# EAGLE design TG_SAT_24V0_V1.4 (EAGLE 9.4.2)
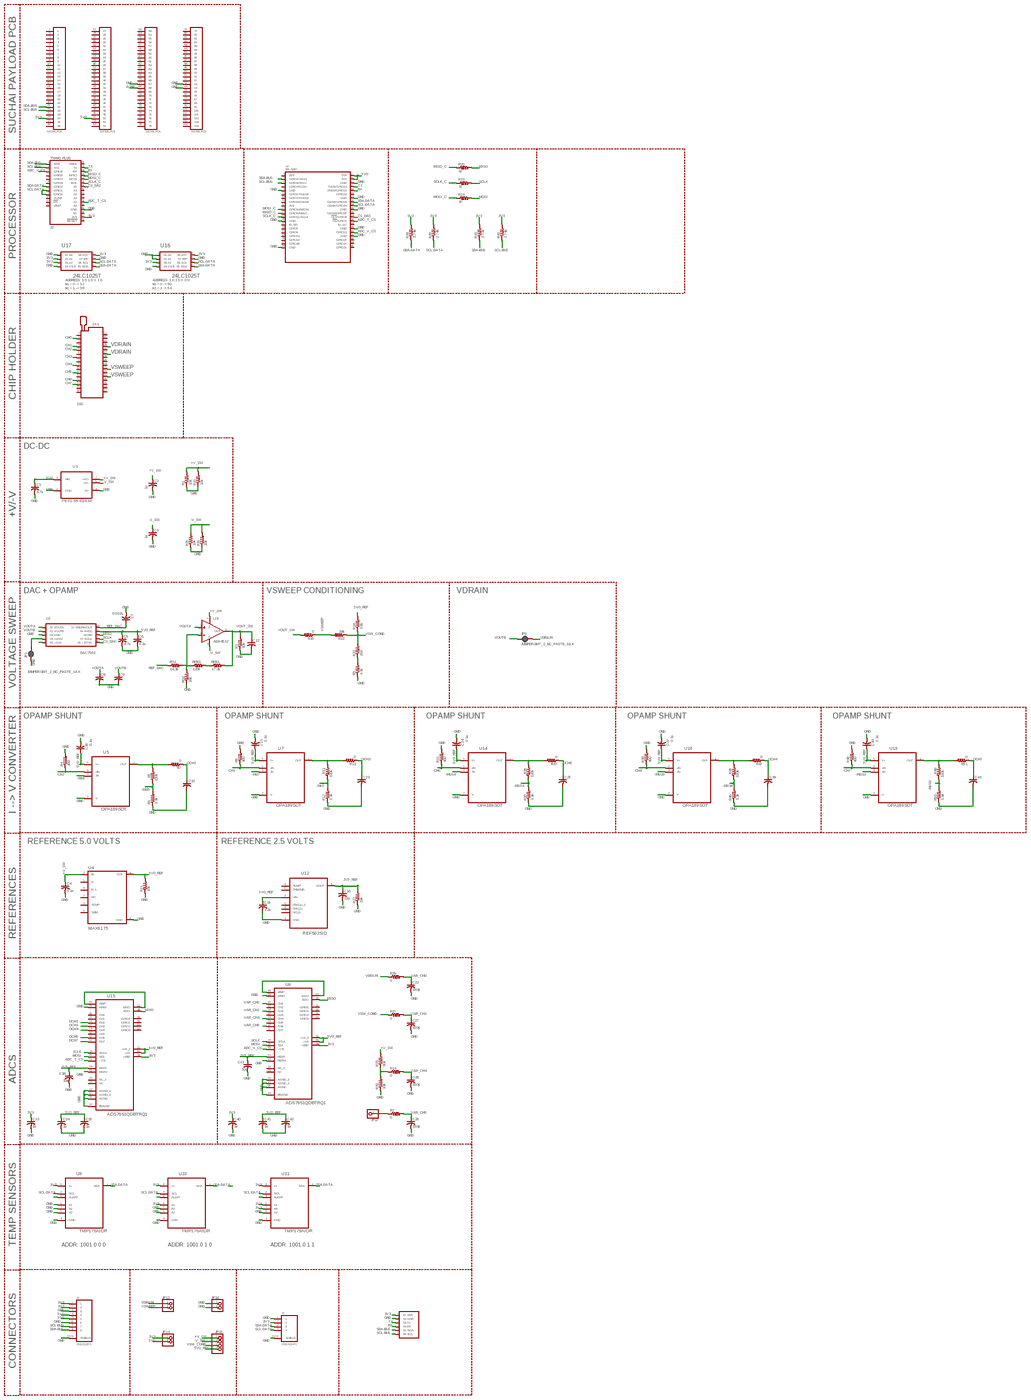
[diagram p0: schematic, sheet 1, overview]
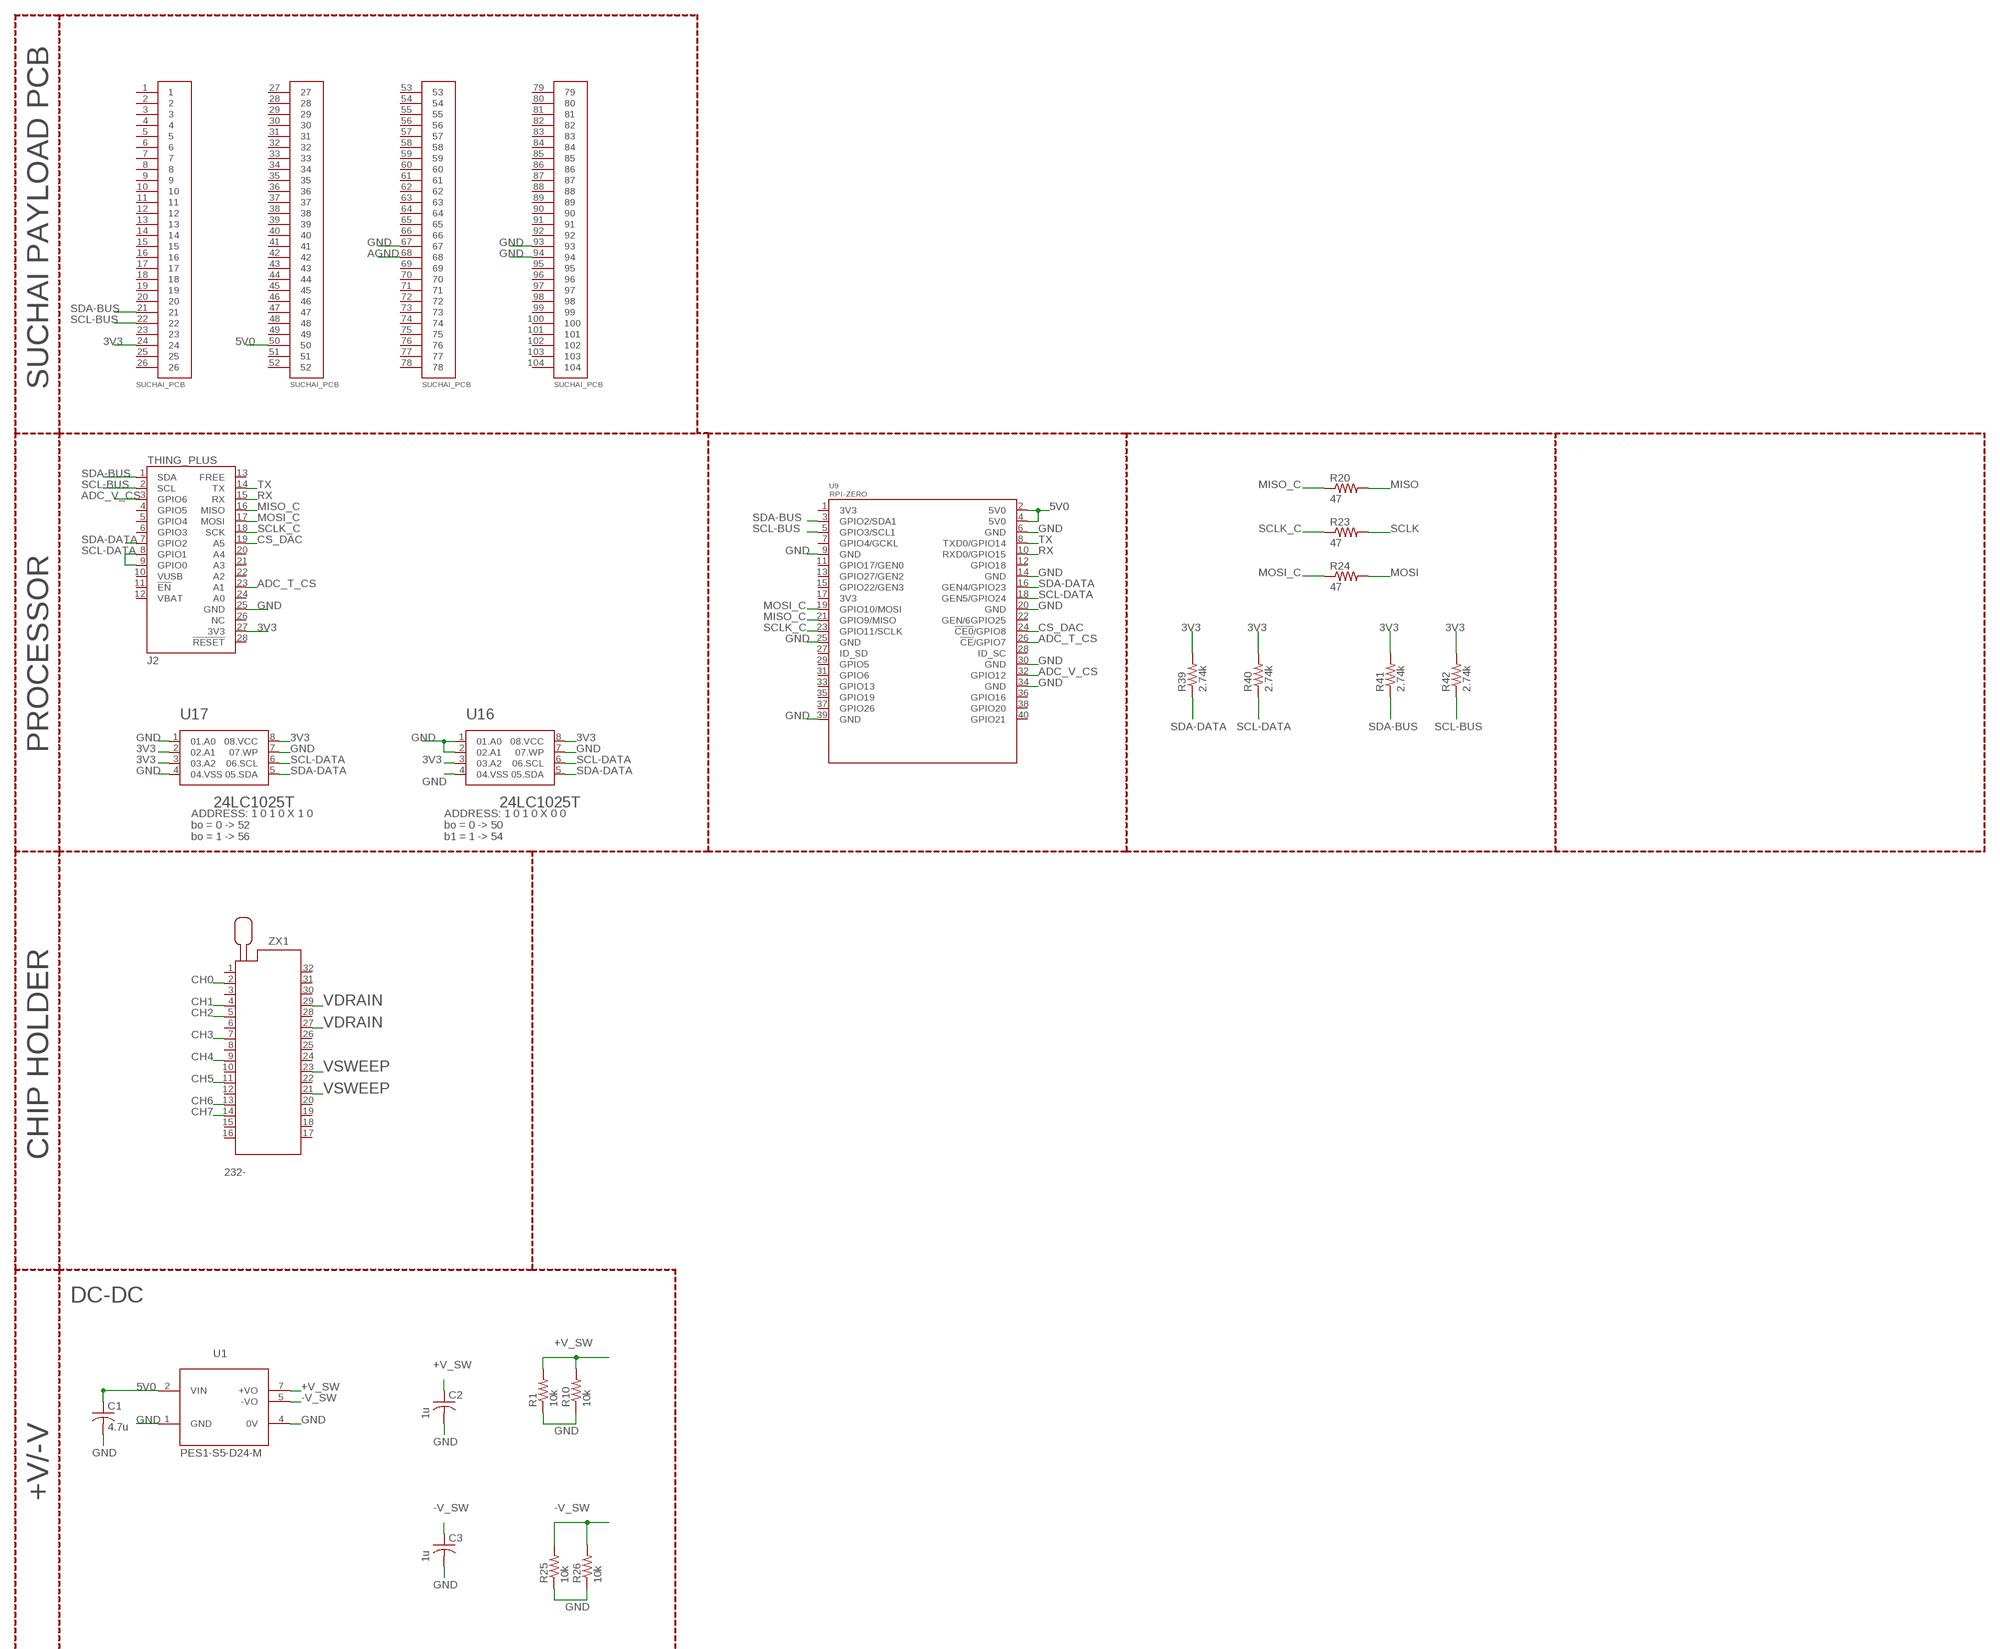
[diagram p1: schematic, sheet 1, part 1 of 4]
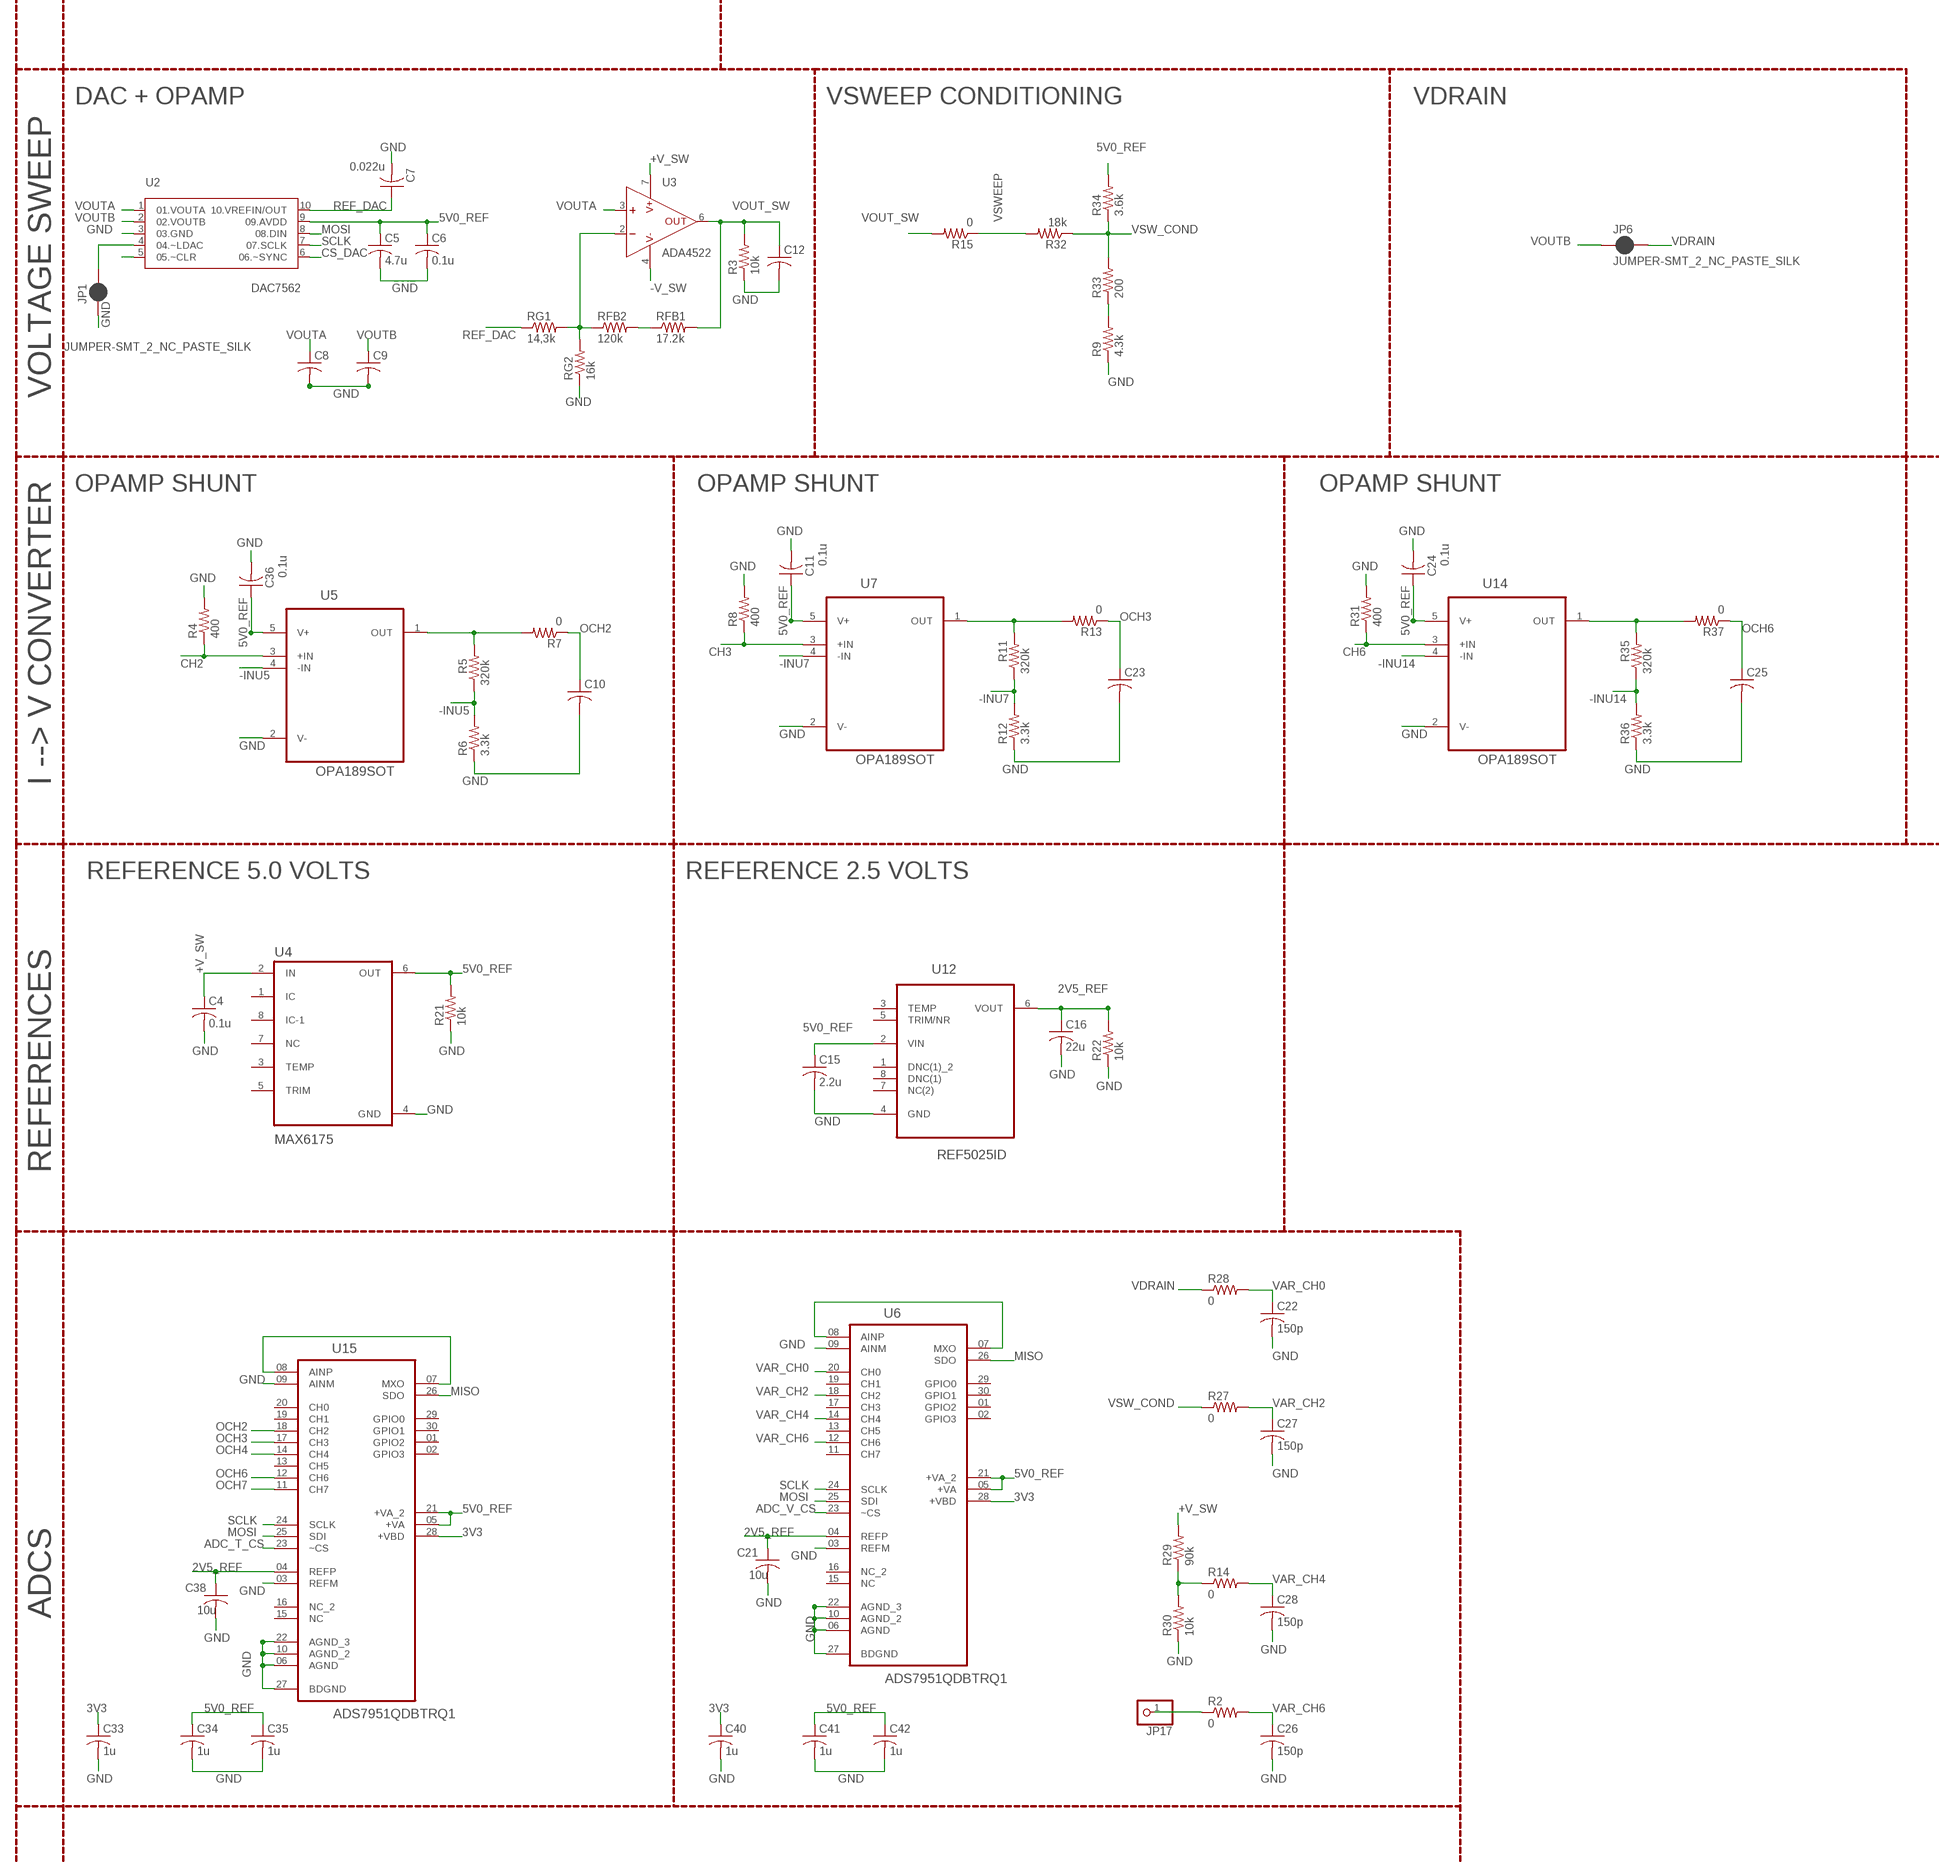
[diagram p2: schematic, sheet 1, part 2 of 4]
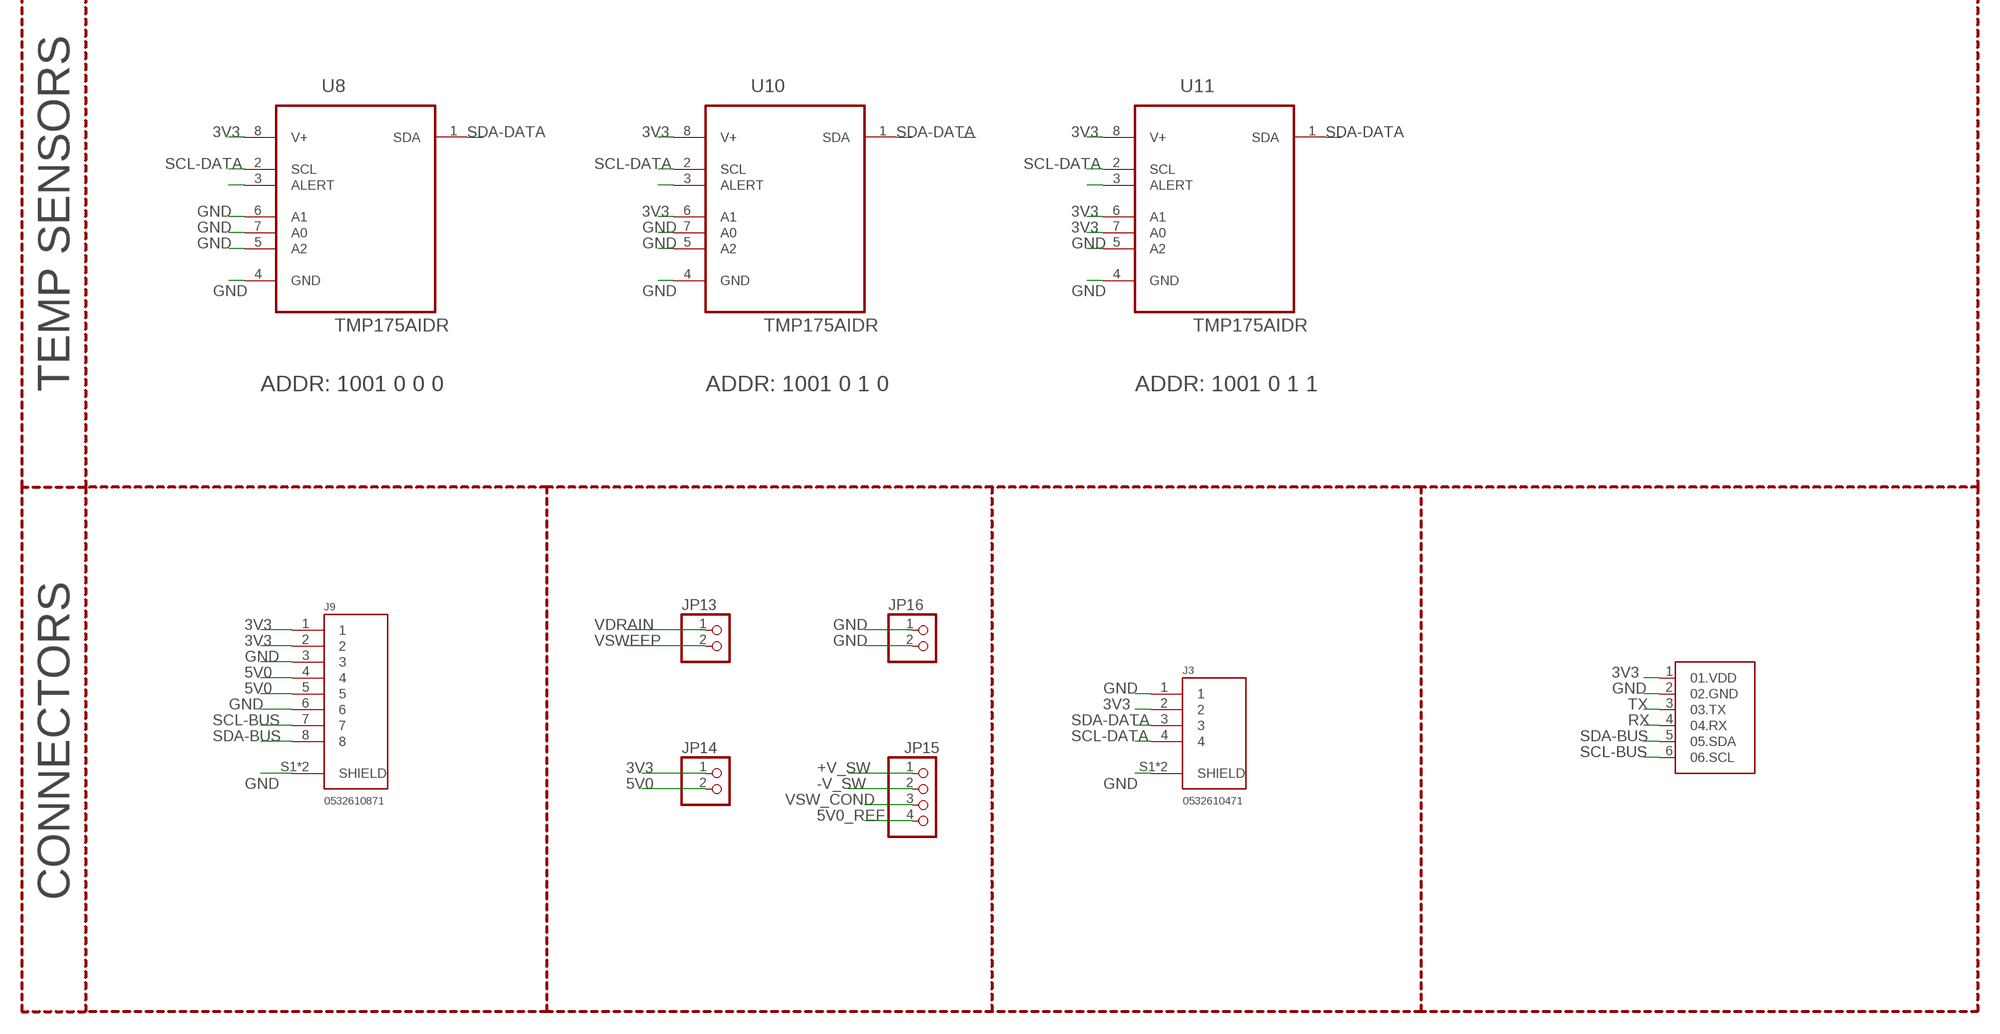
[diagram p3: schematic, sheet 1, part 3 of 4]
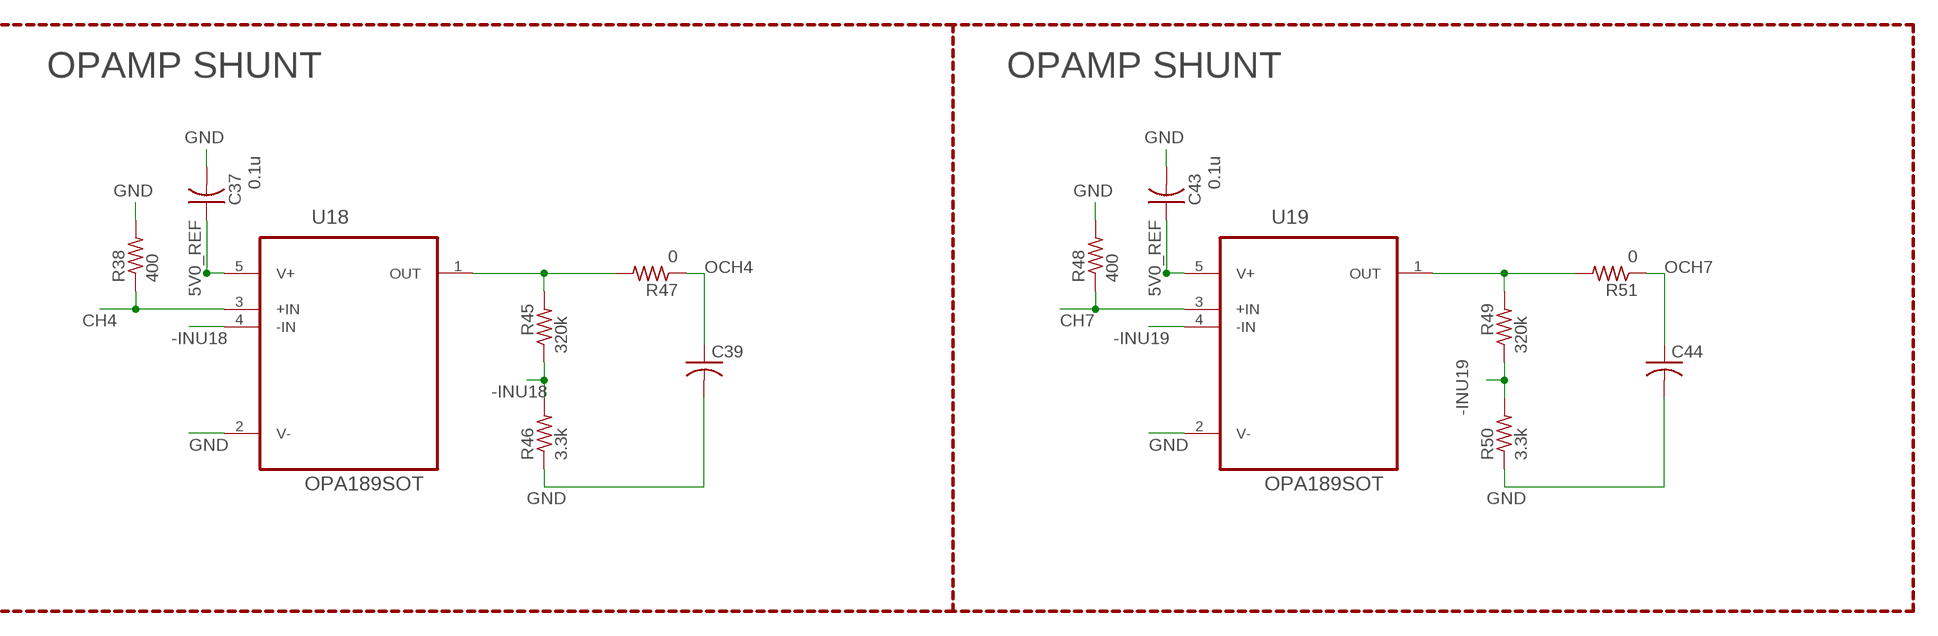
[diagram p4: schematic, sheet 1, part 4 of 4]

## Parts
C1  4.7u  C-USC1206  [C1206]
C2  1u  C-USC0603  [C0603]
C3  1u  C-USC0603  [C0603]
C4  0.1u  C-USC0805  [C0805]
C5  4.7u  C-USC1206  [C1206]
C6  0.1u  C-USC0603  [C0603]
C7  0.022u  C-USC0603  [C0603]
C8  C-USC0603  [C0603]
C9  C-USC0603  [C0603]
C10  C-USC0603  [C0603]
C11  0.1u  C-USC0805  [C0805]
C12  C-USC0603  [C0603]
C15  2.2u  C-USC1206  [C1206]
C16  22u  C-USC1206  [C1206]
C21  10u  C-USC0603  [C0603]
C22  150p  C-USC0603  [C0603]
C23  C-USC0603  [C0603]
C24  0.1u  C-USC0805  [C0805]
C25  C-USC0603  [C0603]
C26  150p  C-USC0603  [C0603]
C27  150p  C-USC0603  [C0603]
C28  150p  C-USC0603  [C0603]
C33  1u  C-USC0603  [C0603]
C34  1u  C-USC0603  [C0603]
C35  1u  C-USC0603  [C0603]
C36  0.1u  C-USC0805  [C0805]
C37  0.1u  C-USC0805  [C0805]
C38  10u  C-USC0603  [C0603]
C39  C-USC0603  [C0603]
C40  1u  C-USC0603  [C0603]
C41  1u  C-USC0603  [C0603]
C42  1u  C-USC0603  [C0603]
C43  0.1u  C-USC0805  [C0805]
C44  C-USC0603  [C0603]
J1  SUCHAI_PCB  [SUCHAI_PCB]
J2  THING_PLUS  [THING_PLUS]
J3  0532610471  [MOLEX_0532610471]
J9  0532610871  [MOLEX_0532610871]
JP1  JUMPER-SMT_2_NC_PASTE_SILK  [SMT-JUMPER_2_NC_PASTE_SILK]
JP6  JUMPER-SMT_2_NC_PASTE_SILK  [SMT-JUMPER_2_NC_PASTE_SILK]
JP13  PINHD-1X2/90  [1X02/90]
JP14  PINHD-1X2/90  [1X02/90]
JP15  PINHD-1X4/90  [1X04/90]
JP16  PINHD-1X2/90  [1X02/90]
JP17  PINHD-1X1  [1X01]
R1  10k  R-US_R0805  [R0805]
R2  0  R-US_R0603  [R0603]
R3  10k  R-US_R0805  [R0805]
R4  400  R-US_R0603  [R0603]
R5  320k  R-US_R1206  [R1206]
R6  3.3k  R-US_R0603  [R0603]
R7  0  R-US_R0603  [R0603]
R8  400  R-US_R0603  [R0603]
R9  4.3k  R-US_R0603  [R0603]
R10  10k  R-US_R0805  [R0805]
R11  320k  R-US_R1206  [R1206]
R12  3.3k  R-US_R0603  [R0603]
R13  0  R-US_R0603  [R0603]
R14  0  R-US_R0603  [R0603]
R15  0  R-US_R0603  [R0603]
R20  47  R-US_R0603  [R0603]
R21  10k  R-US_R0805  [R0805]
R22  10k  R-US_R0805  [R0805]
R23  47  R-US_R0603  [R0603]
R24  47  R-US_R0603  [R0603]
R25  10k  R-US_R0805  [R0805]
R26  10k  R-US_R0805  [R0805]
R27  0  R-US_R0603  [R0603]
R28  0  R-US_R0603  [R0603]
R29  90k  R-US_R0805  [R0805]
R30  10k  R-US_R0603  [R0603]
R31  400  R-US_R0603  [R0603]
R32  18k  R-US_R0603  [R0603]
R33  200  R-US_R0603  [R0603]
R34  3.6k  R-US_R0603  [R0603]
R35  320k  R-US_R1206  [R1206]
R36  3.3k  R-US_R0603  [R0603]
R37  0  R-US_R0603  [R0603]
R38  400  R-US_R0603  [R0603]
R39  2.74k  R-US_R0603  [R0603]
R40  2.74k  R-US_R0603  [R0603]
R41  2.74k  R-US_R0603  [R0603]
R42  2.74k  R-US_R0603  [R0603]
R45  320k  R-US_R1206  [R1206]
R46  3.3k  R-US_R0603  [R0603]
R47  0  R-US_R0603  [R0603]
R48  400  R-US_R0603  [R0603]
R49  320k  R-US_R1206  [R1206]
R50  3.3k  R-US_R0603  [R0603]
R51  0  R-US_R0603  [R0603]
RFB1  17.2k  R-US_R0603  [R0603]
RFB2  120k  R-US_R0805  [R0805]
RG1  14,3k  R-US_R1206  [R1206]
RG2  16k  R-US_R1206  [R1206]
U1  PES1-S5-D24-M  [CONV_PES1-S5-D24-M]
U2  DAC7562  [SOP50P490X110-10N]
U3  ADA4522  [SOP65P490X110-8N]
U4  MAX6175  [SOIC127P600X175-8N]
U5  OPA189SOT  [SOT95P280X145-5N]
U6  ADS7951QDBTRQ1  [TSSOP-30]
U7  OPA189SOT  [SOT95P280X145-5N]
U8  TMP175AIDR  [SOIC127P600X175-8N]
U9  RPI-ZERO  [RASPBERRYPI_BASTELSTUBE_V13_RASPI_BOARD_B+_FULL]
U10  TMP175AIDR  [SOIC127P600X175-8N]
U11  TMP175AIDR  [SOIC127P600X175-8N]
U12  REF5025ID  [SOIC127P600X175-8N]
U14  OPA189SOT  [SOT95P280X145-5N]
U15  ADS7951QDBTRQ1  [TSSOP-30]
U16  24LC1025T  [SOIC127P599X173-8N]
U17  24LC1025T  [SOIC127P599X173-8N]
U18  OPA189SOT  [SOT95P280X145-5N]
U19  OPA189SOT  [SOT95P280X145-5N]
U$1  BRKOUT-PIC16  [BKROUT-PIC16]
ZX1  232-  [3M-MOD]

## Nets
2V5_REF: C16.1 C21.1 C38.1 R22.2 U6.04(REFP) U12.6(VOUT) U15.04(REFP)
3V3: C33.1 C40.1 J1.24 J2.27(3V3) J3.2 J9.1 J9.2 JP14.1 R39.2 R40.2 R41.2 R42.2 U6.28(+VBD) U8.8(V+) U10.6(A1) U10.8(V+) U11.6(A1) U11.7(A0) U11.8(V+) U15.28(+VBD) U16.3(03.A2) U16.8(08.VCC) U17.2(02.A1) U17.3(03.A2) U17.8(08.VCC) U$1.1(01.VDD)
5V0: C1.1 J1.50 J9.4 J9.5 JP14.2 U1.2(VIN) U9.2(5V0) U9.4(5V0)
5V0_REF: C5.1 C6.1 C11.1 C15.1 C24.1 C34.1 C35.1 C36.1 C37.1 C41.1 C42.1 C43.1 JP15.4 R21.2 R34.2 U2.9(09.AVDD) U4.6(OUT) U5.5(V+) U6.05(+VA) U6.21(+VA_2) U7.5(V+) U12.2(VIN) U14.5(V+) U15.05(+VA) U15.21(+VA_2) U18.5(V+) U19.5(V+)
+V_SW: C2.1 C4.1 JP15.1 R1.2 R10.2 R29.2 U1.7(+VO) U3.7(VP) U4.2(IN)
-INU5: R5.1 R6.2 U5.4(-IN)
-INU7: R11.1 R12.2 U7.4(-IN)
-INU14: R35.1 R36.2 U14.4(-IN)
-INU18: R45.1 R46.2 U18.4(-IN)
-INU19: R49.1 R50.2 U19.4(-IN)
-V_SW: C3.1 JP15.2 R25.2 R26.2 U1.5(-VO) U3.4(VM)
ADC_T_CS: J2.23(A1) U9.26(!CE!/GPIO7) U15.23(~CS)
ADC_V_CS: J2.3(GPIO6) U6.23(~CS) U9.32(GPIO12)
AGND: J1.68
CH0: ZX1.2
CH1: ZX1.4
CH2: R4.1 U5.3(+IN) ZX1.5
CH3: R8.1 U7.3(+IN) ZX1.7
CH4: R38.1 U18.3(+IN) ZX1.9
CH5: ZX1.11
CH6: R31.1 U14.3(+IN) ZX1.13
CH7: R48.1 U19.3(+IN) ZX1.14
CS_DAC: J2.19(A5) U2.6(06.~SYNC) U9.24(!CE0!/GPIO8)
GND: C1.2 C2.2 C3.2 C4.2 C5.2 C6.2 C7.2 C8.2 C9.2 C10.2 C11.2 C12.2 C15.2 C16.2 C21.2 C22.2 C23.2 C24.2 C25.2 C26.2 C27.2 C28.2 C33.2 C34.2 C35.2 C36.2 C37.2 C38.2 C39.2 C40.2 C41.2 C42.2 C43.2 C44.2 J1.67 J1.93 J1.94 J2.25(GND) J3.1 J3.S1(SHIELD) J3.S2(SHIELD) J9.3 J9.6 J9.S1(SHIELD) J9.S2(SHIELD) JP1.1 JP16.1 JP16.2 R1.1 R3.1 R4.2 R6.1 R8.2 R9.1 R10.1 R12.1 R21.1 R22.1 R25.1 R26.1 R30.1 R31.2 R36.1 R38.2 R46.1 R48.2 R50.1 RG2.1 U1.1(GND) U1.4(0V) U2.3(03.GND) U4.4(GND) U5.2(V-) U6.03(REFM) U6.06(AGND) U6.09(AINM) U6.10(AGND_2) U6.22(AGND_3) U6.27(BDGND) U7.2(V-) U8.4(GND) U8.5(A2) U8.6(A1) U8.7(A0) U9.6(GND) U9.9(GND) U9.14(GND) U9.20(GND) U9.25(GND) U9.30(GND) U9.34(GND) U9.39(GND) U10.4(GND) U10.5(A2) U10.7(A0) U11.4(GND) U11.5(A2) U12.4(GND) U14.2(V-) U15.03(REFM) U15.06(AGND) U15.09(AINM) U15.10(AGND_2) U15.22(AGND_3) U15.27(BDGND) U16.1(01.A0) U16.2(02.A1) U16.4(04.VSS) U16.7(07.WP) U17.1(01.A0) U17.4(04.VSS) U17.7(07.WP) U18.2(V-) U19.2(V-) U$1.2(02.GND)
MISO: R20.2 U6.26(SDO) U15.26(SDO)
MISO_C: J2.16(MISO) R20.1 U9.21(GPIO9/MISO)
MOSI: R24.2 U2.8(08.DIN) U6.25(SDI) U15.25(SDI)
MOSI_C: J2.17(MOSI) R24.1 U9.19(GPIO10/MOSI)
N$1: RFB1.1 RFB2.2
N$2: R9.2 R33.1
N$8: R5.2 R7.2 U5.1(OUT)
N$9: U6.07(MXO) U6.08(AINP)
N$10: R11.2 R13.2 U7.1(OUT)
N$14: R35.2 R37.2 U14.1(OUT)
N$15: JP1.2 U2.4(04.~LDAC)
N$16: U2.5(05.~CLR)
N$17: R14.1 R29.1 R30.2
N$18: JP17.1 R2.1
N$20: R45.2 R47.2 U18.1(OUT)
N$22: RFB2.1 RG1.2 RG2.2 U3.2(M)
N$24: R49.2 R51.2 U19.1(OUT)
N$25: U15.07(MXO) U15.08(AINP)
N$27: U8.3(ALERT)
N$33: U10.3(ALERT)
N$38: U11.3(ALERT)
OCH2: C10.1 R7.1 U15.18(CH2)
OCH3: C23.1 R13.1 U15.17(CH3)
OCH4: C39.1 R47.1 U15.14(CH4)
OCH6: C25.1 R37.1 U15.12(CH6)
OCH7: C44.1 R51.1 U15.11(CH7)
REF_DAC: C7.1 RG1.1 U2.10(10.VREFIN/OUT)
RX: J2.15(RX) U9.10(RXD0/GPIO15) U$1.4(04.RX)
SCL-BUS: J1.22 J2.2(SCL) J9.7 R42.1 U9.5(GPIO3/SCL1) U$1.6(06.SCL)
SCL-DATA: J2.8(GPIO1) J2.9(GPIO0) J3.4 R40.1 U8.2(SCL) U9.18(GEN5/GPIO24) U10.2(SCL) U11.2(SCL) U16.6(06.SCL) U17.6(06.SCL)
SCLK: R23.2 U2.7(07.SCLK) U6.24(SCLK) U15.24(SCLK)
SCLK_C: J2.18(SCK) R23.1 U9.23(GPIO11/SCLK)
SDA-BUS: J1.21 J2.1(SDA) J9.8 R41.1 U9.3(GPIO2/SDA1) U$1.5(05.SDA)
SDA-DATA: J2.7(GPIO2) J3.3 R39.1 U8.1(SDA) U9.16(GEN4/GPIO23) U10.1(SDA) U11.1(SDA) U16.5(05.SDA) U17.5(05.SDA)
TX: J2.14(TX) U9.8(TXD0/GPIO14) U$1.3(03.TX)
VAR_CH0: C22.1 R28.2 U6.20(CH0)
VAR_CH2: C27.1 R27.2 U6.18(CH2)
VAR_CH4: C28.1 R14.2 U6.14(CH4)
VAR_CH6: C26.1 R2.2 U6.12(CH6)
VDRAIN: JP6.2 JP13.1 R28.1 ZX1.27 ZX1.29
VOUT_SW: C12.1 R3.2 R15.2 RFB1.2 U3.6(OUT)
VOUTA: C8.1 U2.1(01.VOUTA) U3.3(P)
VOUTB: C9.1 JP6.1 U2.2(02.VOUTB)
VSW_COND: JP15.3 R27.1 R32.1 R33.2 R34.1
VSWEEP: JP13.2 R15.1 R32.2 ZX1.21 ZX1.23
Unconnected: J1.1 J1.2 J1.3 J1.4 J1.5 J1.6 J1.7 J1.8 J1.9 J1.10 J1.11 J1.12 J1.13 J1.14 J1.15 J1.16 J1.17 J1.18 J1.19 J1.20 J1.23 J1.25 J1.26 J1.27 J1.28 J1.29 J1.30 J1.31 J1.32 J1.33 J1.34 J1.35 J1.36 J1.37 J1.38 J1.39 J1.40 J1.41 J1.42 J1.43 J1.44 J1.45 J1.46 J1.47 J1.48 J1.49 J1.51 J1.52 J1.53 J1.54 J1.55 J1.56 J1.57 J1.58 J1.59 J1.60 J1.61 J1.62 J1.63 J1.64 J1.65 J1.66 J1.69 J1.70 J1.71 J1.72 J1.73 J1.74 J1.75 J1.76 J1.77 J1.78 J1.79 J1.80 J1.81 J1.82 J1.83 J1.84 J1.85 J1.86 J1.87 J1.88 J1.89 J1.90 J1.91 J1.92 J1.95 J1.96 J1.97 J1.98 J1.99 J1.100 J1.101 J1.102 J1.103 J1.104 J2.4(GPIO5) J2.5(GPIO4) J2.6(GPIO3) J2.10(VUSB) J2.11(!EN) J2.12(VBAT) J2.13(FREE) J2.20(A4) J2.21(A3) J2.22(A2) J2.24(A0) J2.26(NC) J2.28(!RESET) U4.1(IC) U4.3(TEMP) U4.5(TRIM) U4.7(NC) U4.8(IC-1) U6.01(GPIO2) U6.02(GPIO3) U6.11(CH7) U6.13(CH5) U6.15(NC) U6.16(NC_2) U6.17(CH3) U6.19(CH1) U6.29(GPIO0) U6.30(GPIO1) U9.1(3V3) U9.7(GPIO4/GCKL) U9.11(GPIO17/GEN0) U9.12(GPIO18) U9.13(GPIO27/GEN2) U9.15(GPIO22/GEN3) U9.17(3V3) U9.22(GEN/6GPIO25) U9.27(ID_SD) U9.28(ID_SC) U9.29(GPIO5) U9.31(GPIO6) U9.33(GPIO13) U9.35(GPIO19) U9.36(GPIO16) U9.37(GPIO26) U9.38(GPIO20) U9.40(GPIO21) U12.1(DNC(1)_2) U12.3(TEMP) U12.5(TRIM/NR) U12.7(NC(2)) U12.8(DNC(1)) U15.01(GPIO2) U15.02(GPIO3) U15.13(CH5) U15.15(NC) U15.16(NC_2) U15.19(CH1) U15.20(CH0) U15.29(GPIO0) U15.30(GPIO1) ZX1.1 ZX1.3 ZX1.6 ZX1.8 ZX1.10 ZX1.12 ZX1.15 ZX1.16 ZX1.17 ZX1.18 ZX1.19 ZX1.20 ZX1.22 ZX1.24 ZX1.25 ZX1.26 ZX1.28 ZX1.30 ZX1.31 ZX1.32

## Notes on the sheet
- SUCHAI PAYLOAD PCB
- PROCESSOR
- ADDRESS: 1 0 1 0 X 1 0 
  bo = 0 -> 52
  bo = 1 -> 56
- ADDRESS: 1 0 1 0 X 0 0
  bo = 0 -> 50
  b1 = 1 -> 54
- CHIP HOLDER
- DC-DC
- +V/-V
- DAC + OPAMP | VSWEEP CONDITIONING | VDRAIN
- VOLTAGE SWEEP
- OPAMP SHUNT | OPAMP SHUNT | OPAMP SHUNT | OPAMP SHUNT | OPAMP SHUNT
- I --> V CONVERTER
- REFERENCE 5.0 VOLTS | REFERENCE 2.5 VOLTS
- REFERENCES
- ADCS
- TEMP SENSORS | ADDR: 1001 0 0 0 | ADDR: 1001 0 1 0 | ADDR: 1001 0 1 1
- CONNECTORS

## Library data of the parts
C1-C12 C15 C16 C21-C28 C33-C44 = rcl:C-US: CAPACITOR, American symbol; SPICEPREFIX: C
J1 = SPEL:SUCHAI_PCB: ASSEMBLY, SOCKET STRIP .016 X .031 TAIL.
J2 = EMERSON:THING_PLUS
J3 = PLANTSAT:0532610471: Conn Shrouded Header HDR 4 POS 1.25mm Solder RA SMD PicoBlade™ Embossed T/R; DESCRIPTION: Conn Shrouded Header HDR 4 POS 1.25mm Solder RA SMD PicoBlade™ Embossed T/R; DIGI-KEY_PART_NUMBER: WM7622CT-ND; DIGI-KEY_PURCHASE_URL: https://www.digikey.com/product-detail/en/molex/0532610471/WM7622CT-ND/699109?utm_source=snapeda&utm_medium=aggregator&utm_campaign=symbol; MF: Molex; MP: 0532610471; PACKAGE: None
J9 = PLANTSAT:0532610871: Conn Shrouded Header HDR 8 POS 1.25mm Solder RA SMD PicoBlade™ Embossed T/R
JP1 JP6 = SparkFun-Jumpers:JUMPER-SMT_2_NC_PASTE: Normally closed solder jumper This jumper has an aperture in the stencil to allow solder paste to bridge the split in the wire so it's normally closed (NC). Wick off the solder to open the connection. Reapply solder to reclose the connection.
JP13 JP14 JP16 = pinhead:PINHD-1X2: PIN HEADER
JP15 = pinhead:PINHD-1X4: PIN HEADER
JP17 = pinhead:PINHD-1X1: PIN HEADER
R1-R15 R20-R42 R45-R51 RFB1 RFB2 RG1 RG2 = rcl:R-US_: RESISTOR, American symbol; SPICEPREFIX: R
U1 = SPEL:PES1-S5-D24-M: 12/-12 Vdc, 0.042 A, 1 W, 10.8~13.2 Vdc Input Range; AVAILABILITY: Unavailable; CUI_PURCHASE_URL: https://www.cui.com/product/dc-dc-converters/isolated/pes1-m-series?utm_source=snapeda.com&utm_medium=referral&utm_campaign=snapedaBOM; DESCRIPTION: 1 W, 1:1 Input Range, Single/Dual Unregulated Output, SMT, 3000 Vdc Isolation, High Temp Range, Dc-Dc Converter; MF: CUI; MP: PES1-S5-D24-M; PACKAGE: SMD-8 CUI; PRICE: None
U2 = SPEL:DAC7562
U3 = SPEL:ADA4522
U4 = SPEL:MAX6175
U5 U7 U14 U18 U19 = SPEL:OPA189
U6 U15 = SPEL:ADS7951QDBTRQ1
U8 U10 U11 = SPEL:TMP175AIDR: Digital Temperature Sensor with Two-Wire Interface; MPN: TMP175AIDR; OC_FARNELL: -; OC_NEWARK: 01J0913; PACKAGE: SOIC-8; SUPPLIER: Texas Instruments
U9 = RPI-Zero:RPI-ZERO
U12 = SPEL:REF5025ID: Low-Noise, Very Low Drift, Precision VOLTAGE REFERENCE; MPN: REF5025ID; OC_FARNELL: 1702829; OC_NEWARK: 50M8897; PACKAGE: SOIC-8; SUPPLIER: Texas Instruments
U16 U17 = SPEL:24LC1025T
U$1 = SPEL:BRKOUT-PIC16
ZX1 = SPEL:232-?: Zero Insertion Force Socked Source: http://www.3M.com/ehpd

## Board
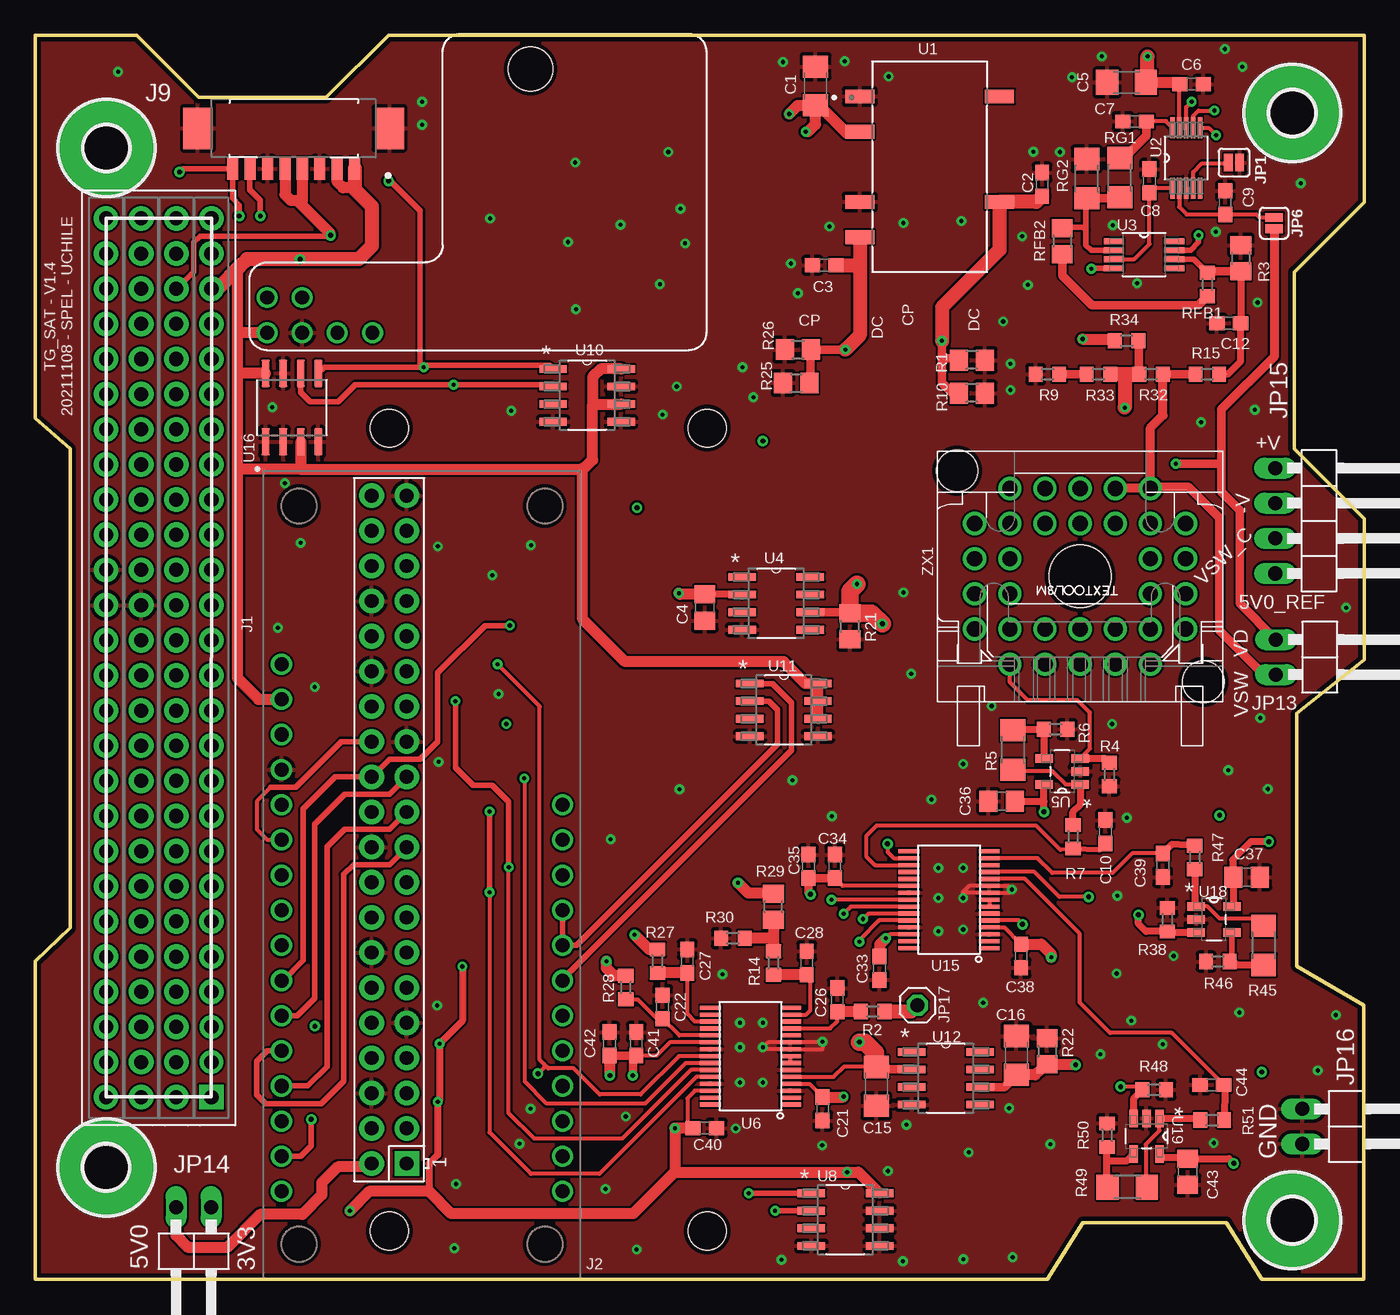
[diagram p5: board, top side]
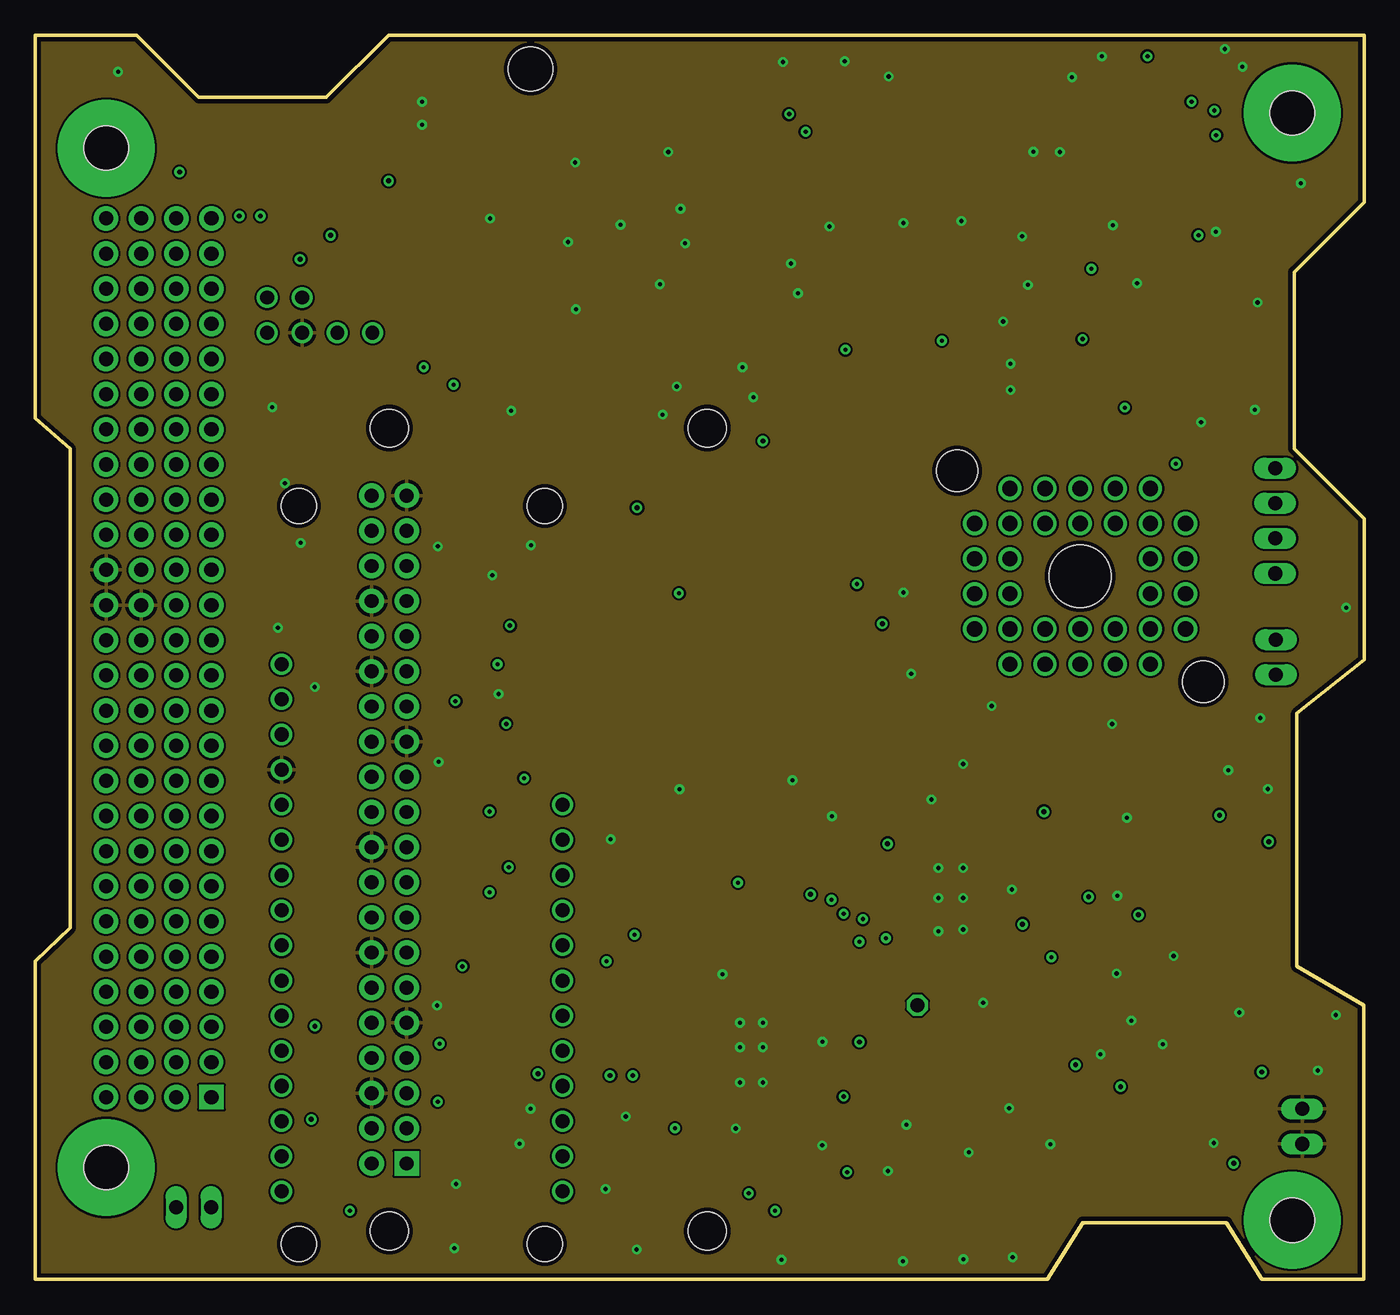
[diagram p6: board, inner layer Route2]
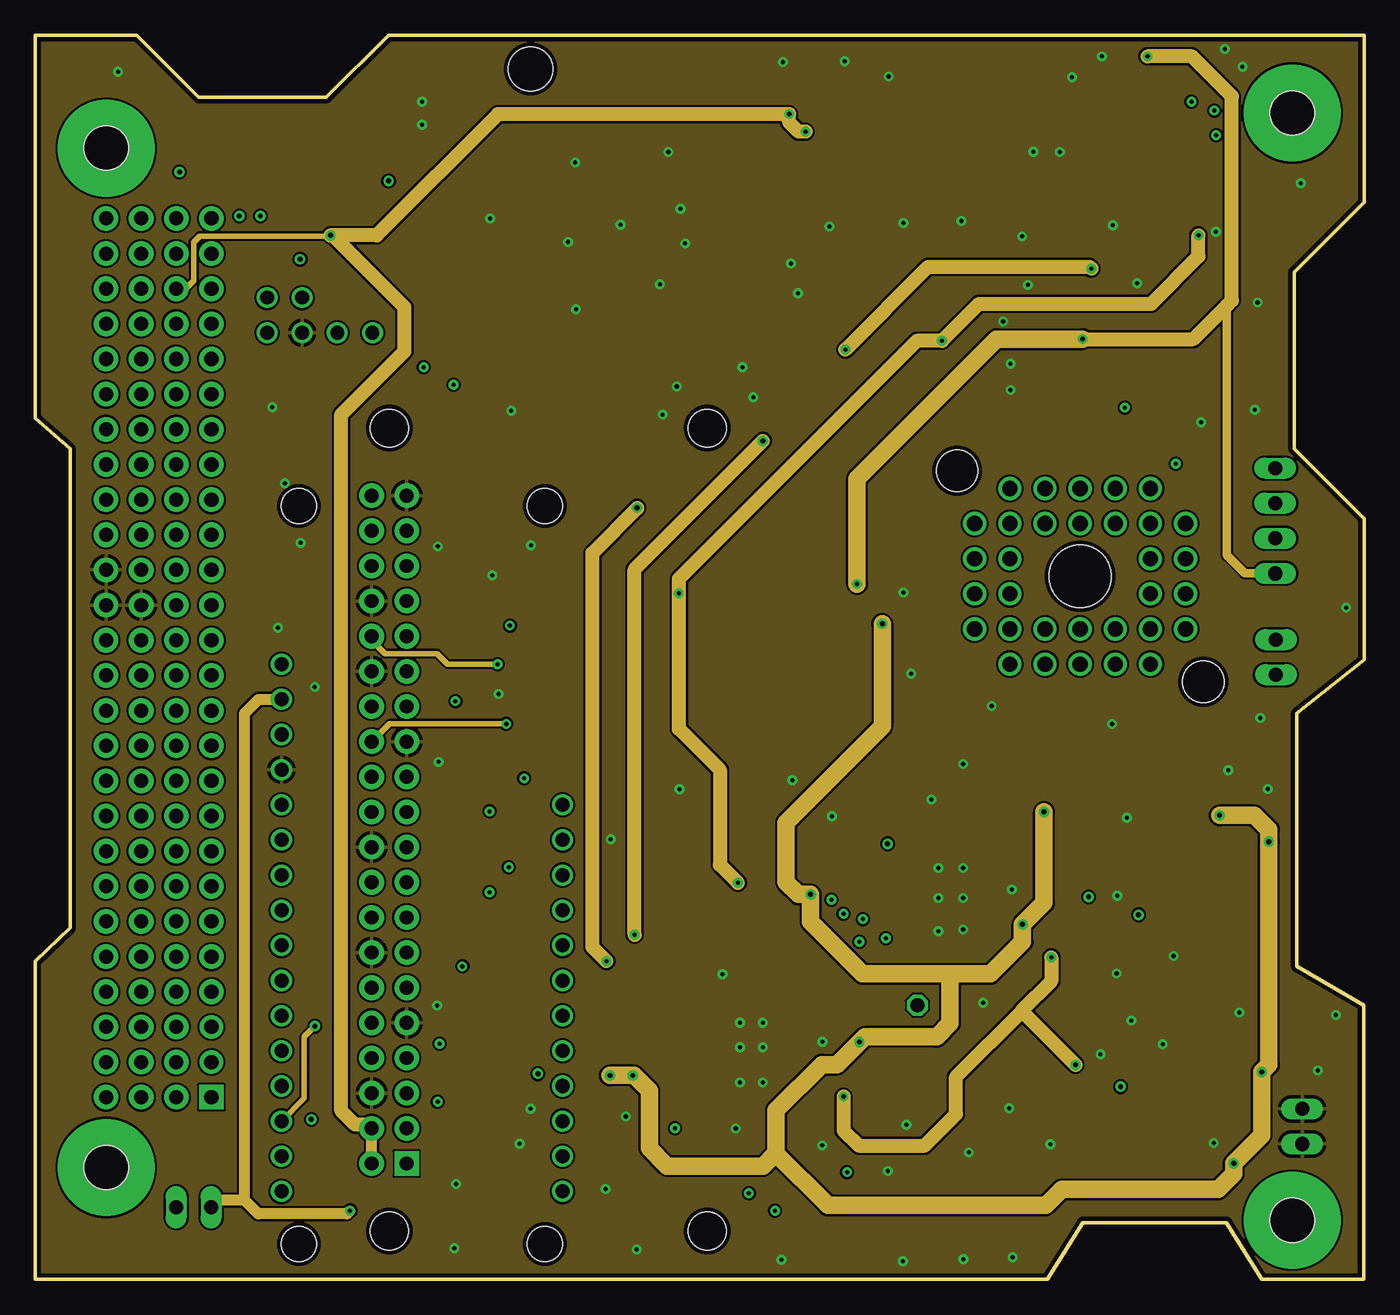
[diagram p7: board, inner layer Route15]
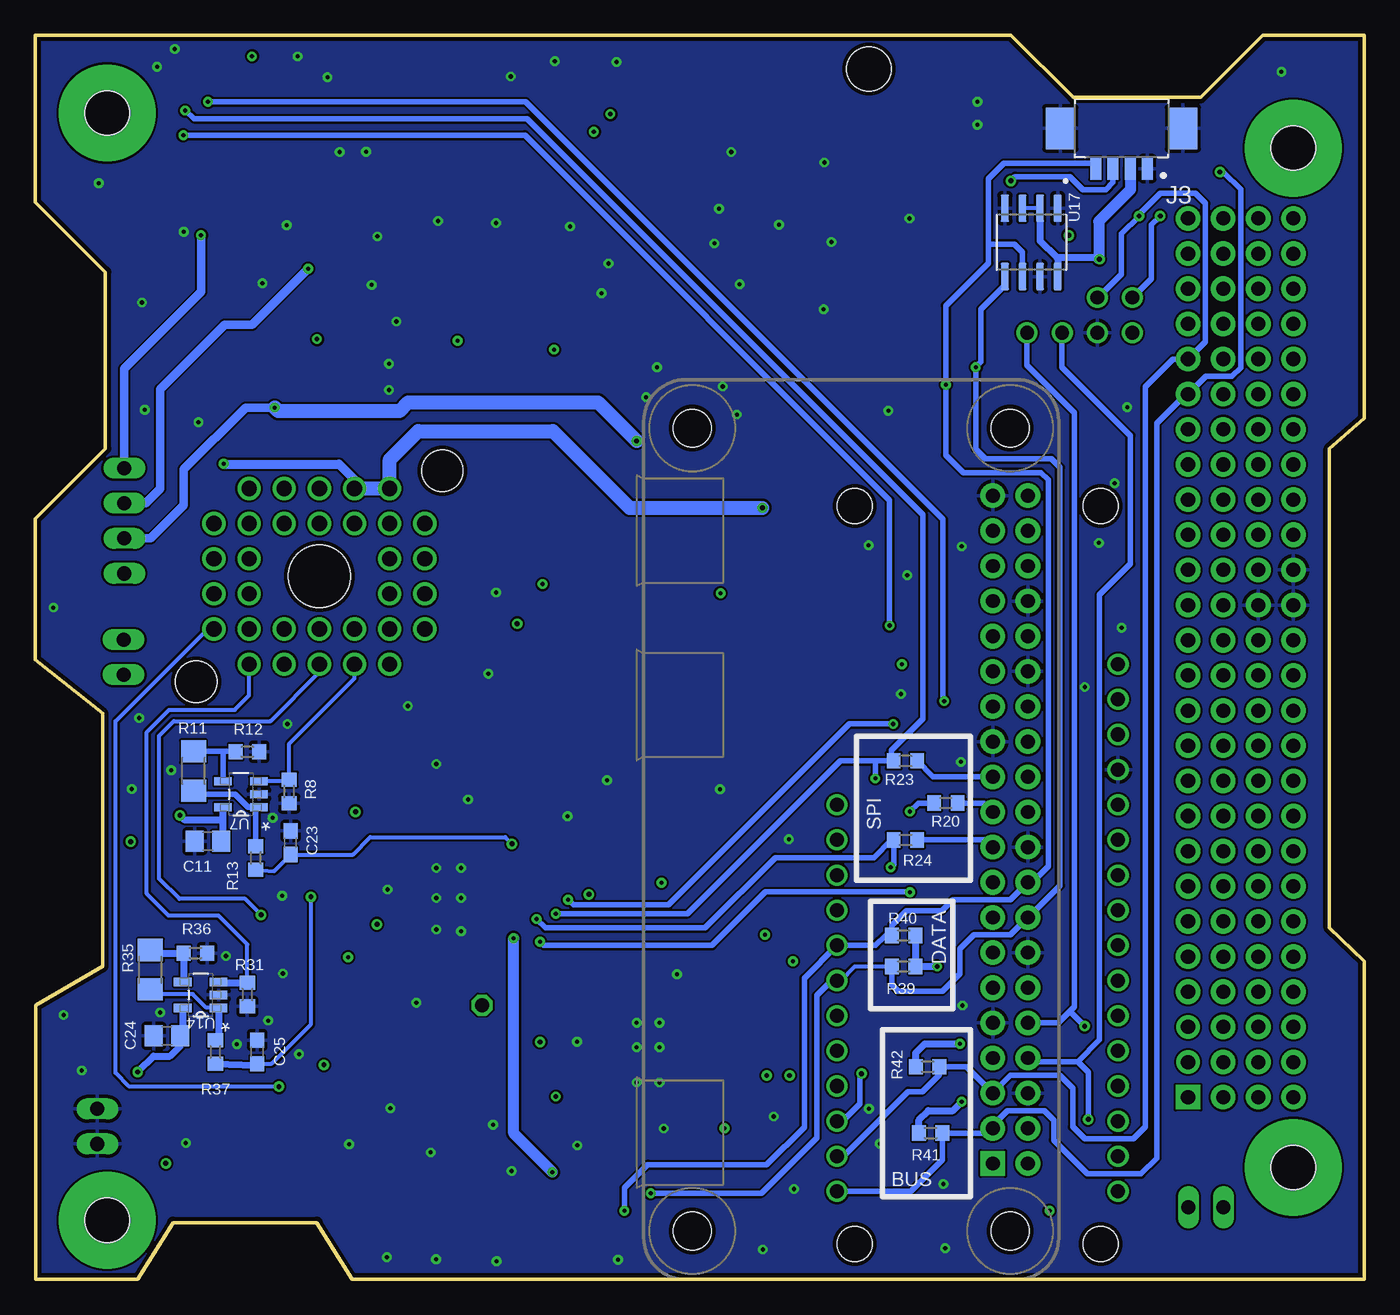
[diagram p8: board, bottom side, seen from below]

Size 96.16 x 90.01 mm. Coordinates in mm from the lower left corner, seen from the top.
Copper layers (1+2*15+16): Top 0.035mm / dielectric 1.5mm / Route2 0.035mm / dielectric 0.15mm / Route15 0.035mm / dielectric 0.2mm / Bottom 0.035mm
Design rules "default *": minimum track width 6mil, minimum drill 0.3mm, track to track 6mil, track to pad 6mil, pad to pad 6mil, via to via 6mil, smd to smd 6mil, copper to edge 12mil, drill to drill 6mil, minimum pad ring 10mil, minimum via ring 8mil, stop-mask expansion 4mil, vias tented up to drill 0mil, thermal gap 10mil
Holes 4.5 mm at 75.58,50.86

### Footprints (pad centres in the part's own frame; a part is rotated, then mirrored left to right if it is on the bottom)
C1206 = smd 1.6 x 1.8: 1 -1.4,0; 2 1.4,0
C0603 = smd 1.1 x 1: 1 -0.85,0; 2 0.85,0
C0805 = smd 1.3 x 1.5: 1 -0.95,0; 2 0.95,0
SUCHAI_PCB = drill 1.016 pad 1.778 square: 1 12.72,13.16 | drill 1.016 pad 1.7: 2 12.72,15.7; 3 12.72,18.24 | drill 1.016 pad 1.778: 4 12.72,20.78; 5 12.72,23.32; 6 12.72,25.86; 7 12.72,28.4; 8 12.72,30.94; 9 12.72,33.48; 10 12.72,36.02; 11 12.72,38.56; 12 12.72,41.1; 13 12.72,43.64; 14 12.72,46.18; 15 12.72,48.72; 16 12.72,51.26; 17 12.72,53.8; 18 12.72,56.34; 19 12.72,58.88; 20 12.72,61.42; 21 12.72,63.96; 22 12.72,66.5; 23 12.72,69.04; 24 12.72,71.58; 25 12.72,74.12; 26 12.72,76.66; 27 10.18,13.16; 28 10.18,15.7; 29 10.18,18.24; 30 10.18,20.78; 31 10.18,23.32; 32 10.18,25.86; 33 10.18,28.4; 34 10.18,30.94; 35 10.18,33.48; 36 10.18,36.02; 37 10.18,38.56; 38 10.18,41.1; 39 10.18,43.64; 40 10.18,46.18; 41 10.18,48.72; 42 10.18,51.26; 43 10.18,53.8; 44 10.18,56.34; 45 10.18,58.88; 46 10.18,61.42; 47 10.18,63.96; 48 10.18,66.5; 49 10.18,69.04; 50 10.18,71.58; 51 10.18,74.12; 52 10.18,76.66; 53 7.64,13.16; 54 7.64,15.7; 55 7.64,18.24; 56 7.64,20.78; 57 7.64,23.32; 58 7.64,25.86; 59 7.64,28.4; 60 7.64,30.94; 61 7.64,33.48; 62 7.64,36.02; 63 7.64,38.56; 64 7.64,41.1; 65 7.64,43.64; 66 7.64,46.18; 67 7.64,48.72; 68 7.64,51.26; 69 7.64,53.8; 70 7.64,56.34; 71 7.64,58.88; 72 7.64,61.42; 73 7.64,63.96; 74 7.64,66.5; 75 7.64,69.04; 76 7.64,71.58; 77 7.64,74.12; 78 7.64,76.66; 79 5.1,13.16; 80 5.1,15.7; 81 5.1,18.24; 82 5.1,20.78; 83 5.1,23.32; 84 5.1,25.86; 85 5.1,28.4; 86 5.1,30.94; 87 5.1,33.48; 88 5.1,36.02; 89 5.1,38.56; 90 5.1,41.1; 91 5.1,43.64; 92 5.1,46.18; 93 5.1,48.72; 94 5.1,51.26; 95 5.1,53.8; 96 5.1,56.34; 97 5.1,58.88; 98 5.1,61.42; 99 5.1,63.96; 100 5.1,66.5; 101 5.1,69.04; 102 5.1,71.58; 103 5.1,74.12; 104 5.1,76.66 | drill 3.2 pad 7: GND 5.12,8.08; P$2 90.85,4.27; P$3 90.85,84.28; P$4 5.12,81.74 | hole 3.2: 5.12,8.08; 90.85,4.27; 90.85,84.28; 5.12,81.74
THING_PLUS = drill 1.016: 1 -10.16,19.05; 2 -10.16,16.51; 3 -10.16,13.97; 4 -10.16,11.43; 5 -10.16,8.89; 6 -10.16,6.35; 7 -10.16,3.81; 8 -10.16,1.27; 9 -10.16,-1.27; 10 -10.16,-3.81; 11 -10.16,-6.35; 12 -10.16,-8.89; 13 10.16,19.05; 14 10.16,16.51; 15 10.16,13.97; 16 10.16,11.43; 17 10.16,8.89; 18 10.16,6.35; 19 10.16,3.81; 20 10.16,1.27; 21 10.16,-1.27; 22 10.16,-3.81; 23 10.16,-6.35; 24 10.16,-8.89; 25 10.16,-11.43; 26 10.16,-13.97; 27 10.16,-16.51; 28 10.16,-19.05 | hole 2.54: -8.89,22.86; 8.89,22.86; -8.89,-30.48; 8.89,-30.48
MOLEX_0532610471 = smd 0.8 x 1.6: 1 -1.875,0; 2 -0.625,0; 3 0.625,0; 4 1.875,0 | smd 2.1 x 3: S1 -4.425,-2.9; S2 4.425,-2.9
MOLEX_0532610871 = smd 0.8 x 1.6: 1 -4.415,0; 2 -3.145,0; 3 -1.875,0; 4 -0.625,0; 5 0.625,0; 6 1.875,0; 7 3.145,0; 8 4.415,0 | smd 2.1 x 3: S1 -6.925,-2.9; S2 6.925,-2.9
SMT-JUMPER_2_NC_PASTE_SILK = smd 0.635 x 1.27: 1 -0.406,0; 2 0.406,0
1X02/90 = drill 1.016 long: 1 -1.27,-3.81; 2 1.27,-3.81
1X04/90 = drill 1.016 long: 1 -3.81,-3.81; 2 -1.27,-3.81; 3 1.27,-3.81; 4 3.81,-3.81
1X01 = drill 1.016 octagon: 1 0,0
R0805 = smd 1.3 x 1.5: 1 -0.95,0; 2 0.95,0
R0603 = smd 1 x 1.1: 1 -0.85,0; 2 0.85,0
R1206 = smd 1.6 x 1.803: 1 -1.422,0; 2 1.422,0
CONV_PES1-S5-D24-M = smd 2.1 x 1: 1 -5.05,5.08; 2 -5.05,2.54; 4 -5.05,-2.54; 5 -5.05,-5.08; 7 5.05,-2.54; 10 5.05,5.08
SOP50P490X110-10N = smd 1.499 x 0.33: 1 -2.184,0.991; 2 -2.184,0.508; 3 -2.184,0; 4 -2.184,-0.508; 5 -2.184,-0.991; 6 2.184,-0.991; 7 2.184,-0.508; 8 2.184,0; 9 2.184,0.508; 10 2.184,0.991
SOP65P490X110-8N = smd 1.422 x 0.432: 1 -2.184,0.965; 2 -2.184,0.33; 3 -2.184,-0.33; 4 -2.184,-0.965; 5 2.184,-0.965; 6 2.184,-0.33; 7 2.184,0.33; 8 2.184,0.965
SOIC127P600X175-8N = smd 1.981 x 0.559: 1 -2.464,1.905; 2 -2.464,0.635; 3 -2.464,-0.635; 4 -2.464,-1.905; 5 2.464,-1.905; 6 2.464,-0.635; 7 2.464,0.635; 8 2.464,1.905
SOT95P280X145-5N = smd 1.27 x 0.6: 1 -1.295,0.94; 2 -1.295,0; 3 -1.295,-0.94; 4 1.295,-0.94; 5 1.295,0.94
TSSOP-30 = smd 1.5 x 0.3: 01 -2.9,3.5; 02 -2.9,3; 03 -2.9,2.5; 04 -2.9,2; 05 -2.9,1.5; 06 -2.9,1; 07 -2.9,0.5; 08 -2.9,0; 09 -2.9,-0.5; 10 -2.9,-1; 11 -2.9,-1.5; 12 -2.9,-2; 13 -2.9,-2.5; 14 -2.9,-3; 15 -2.9,-3.5; 16 2.9,-3.5; 17 2.9,-3; 18 2.9,-2.5; 19 2.9,-2; 20 2.9,-1.5; 21 2.9,-1; 22 2.9,-0.5; 23 2.9,0; 24 2.9,0.5; 25 2.9,1; 26 2.9,1.5; 27 2.9,2; 28 2.9,2.5; 29 2.9,3; 30 2.9,3.5
RASPBERRYPI_BASTELSTUBE_V13_RASPI_BOARD_B+_FULL = drill 1 pad 1.778 square: 1 8.37,25.23 | drill 1 pad 1.778: 2 8.37,27.77; 3 10.91,25.23; 4 10.91,27.77; 5 13.45,25.23; 6 13.45,27.77; 7 15.99,25.23; 8 15.99,27.77; 9 18.53,25.23; 10 18.53,27.77; 11 21.07,25.23; 12 21.07,27.77; 13 23.61,25.23; 14 23.61,27.77; 15 26.15,25.23; 16 26.15,27.77; 17 28.69,25.23; 18 28.69,27.77; 19 31.23,25.23; 20 31.23,27.77; 21 33.77,25.23; 22 33.77,27.77; 23 36.31,25.23; 24 36.31,27.77; 25 38.85,25.23; 26 38.85,27.77; 27 41.39,25.23; 28 41.39,27.77; 29 43.93,25.23; 30 43.93,27.77; 31 46.47,25.23; 32 46.47,27.77; 33 49.01,25.23; 34 49.01,27.77; 35 51.55,25.23; 36 51.55,27.77; 37 54.09,25.23; 38 54.09,27.77; 39 56.63,25.23; 40 56.63,27.77 | hole 2.75: 3.5,3.5; 3.5,26.5; 61.5,3.5; 61.5,26.5
SOIC127P599X173-8N = smd 1.98 x 0.59: 1 -2.47,1.905; 2 -2.47,0.635; 3 -2.47,-0.635; 4 -2.47,-1.905; 5 2.47,-1.905; 6 2.47,-0.635; 7 2.47,0.635; 8 2.47,1.905
BKROUT-PIC16 = drill 1: 1 1.27,1.27; 2 3.81,1.27; 3 6.35,1.27; 4 8.89,1.27; 5 1.27,3.81; 6 3.81,3.81 | hole 3.2: 20.32,20.32
3M-MOD = drill 1.1 pad 1.676: 1 1.27,5.08; 2 -1.27,7.62; 3 -1.27,5.08; 4 -3.81,7.62; 5 -6.35,5.08; 6 -3.81,5.08; 7 -6.35,2.54; 8 -3.81,2.54; 9 -6.35,0; 10 -3.81,0; 11 -6.35,-2.54; 12 -3.81,-2.54; 13 -6.35,-5.08; 14 -3.81,-7.62; 15 -3.81,-5.08; 16 -1.27,-7.62; 17 -1.27,-5.08; 18 1.27,-7.62; 19 1.27,-5.08; 20 3.81,-7.62; 21 6.35,-5.08; 22 3.81,-5.08; 23 6.35,-2.54; 24 3.81,-2.54; 25 6.35,0; 26 3.81,0; 27 6.35,2.54; 28 3.81,2.54; 29 6.35,5.08; 30 3.81,7.62; 31 3.81,5.08; 32 1.27,7.62 | hole 3: 7.62,8.89; -7.62,-8.89

### Placement (x,y rotation side)
C1  56.45,86.3 90 top
C2  72.83,79.18 90 top
C3  57.09,73.34 180 top
C4  48.45,48.6 270 top
C5  78.93,86.55 180 top
C6  83.63,86.42 0 top
C7  79.51,83.73 180 top
C8  80.58,79.44 90 top
C9  86.07,77.86 90 top
C10  77.41,32.4 90 top
C11  83.63,31.71 180 bottom
C12  86.32,69.15 180 top
C15  60.85,14.01 270 top
C16  70.98,16.24 90 top
C21  56.96,12.38 270 top
C22  45.4,19.75 90 top
C23  77.66,31.61 90 bottom
C24  86.6,17.67 180 bottom
C25  80.07,16.5 90 bottom
C26  58.03,20.26 90 top
C27  47.18,23.05 90 top
C28  55.82,22.92 90 top
C33  61.07,22.54 270 top
C34  57.85,29.91 90 top
C35  55.94,29.91 90 top
C36  69.91,34.61 180 top
C37  87.62,29.12 0 top
C38  71.31,23.43 270 top
C39  81.55,29.98 270 top
C40  48.45,10.99 0 top
C41  43.5,17.08 90 top
C42  41.57,17.08 90 top
C43  83.35,7.84 270 top
C44  85.1,14.11 180 top
J1  0.06,0.06 0 top
J2  28,25.46 180 top
J3  17.59,80.33 180 bottom
J9  18.73,80.33 180 top
JP1  86.7,80.76 180 top
JP6  89.6,76.39 270 top
JP13  93.54,45.02 270 top
JP14  11.49,1.46 180 top
JP15  93.48,54.88 270 top
JP16  95.44,11.11 270 top
JP17  63.82,19.88 0 top
R1  67.75,66.48 180 top
R2  60.59,19.42 180 top
R3  87.19,73.85 270 top
R4  77.69,36.54 270 top
R5  70.73,38.32 270 top
R6  73.8,39.81 180 top
R7  75.07,32.04 90 top
R8  77.76,35.32 270 bottom
R9  73.22,65.47 0 top
R10  67.75,64.1 180 top
R11  84.67,36.79 270 bottom
R12  80.78,38.19 180 bottom
R13  80.18,30.52 90 bottom
R14  53.4,22.92 270 top
R15  84.77,65.47 0 top
R20  30.29,34.48 180 bottom
R21  58.94,47.26 90 top
R22  73.19,16.55 270 top
R23  33.21,37.53 180 bottom
R24  33.21,31.81 180 bottom
R25  55.05,64.83 0 top
R26  55.18,67.25 0 top
R27  45.02,23.05 270 top
R28  42.74,21.15 270 top
R29  53.4,26.99 90 top
R30  50.48,24.7 0 top
R31  80.78,20.64 270 bottom
R32  80.71,65.47 0 top
R33  76.9,65.47 0 top
R34  78.93,67.88 180 top
R35  87.8,22.44 270 bottom
R36  84.54,23.63 180 bottom
R37  83.1,16.5 90 bottom
R38  81.88,26.05 90 top
R39  33.34,22.67 0 bottom
R40  33.34,24.9 0 bottom
R41  31.38,10.63 180 bottom
R42  31.61,15.43 180 bottom
R45  88.84,24.19 90 top
R46  85.53,23.03 0 top
R47  83.86,30.54 270 top
R48  80.94,13.75 0 top
R49  78.98,6.72 0 top
R50  77.53,10.48 270 top
R51  85.13,11.57 180 top
RFB1  84.77,71.95 90 top
RFB2  74.28,75.07 270 top
RG1  78.45,79.67 270 top
RG2  76.06,79.59 270 top
U1  64.71,80.45 0 top
U2  83.25,81.09 90 top
U3  80.2,74.1 0 top
U4  53.61,48.91 0 top
U5  74.28,36.77 180 top
U6  51.75,16.19 180 top
U7  81.24,35.12 180 bottom
U8  58.61,4.38 0 top
U9  52.13,0.06 90 top
U10  39.94,63.94 0 top
U11  54.17,41.21 0 top
U12  65.87,14.59 0 top
U14  84.16,20.61 180 bottom
U15  66.1,27.5 180 top
U16  18.61,63.06 90 top
U17  24.12,74.99 270 bottom
U18  85.26,26.07 0 top
U19  80.38,10.4 270 top
U$1  15.53,67.2 0 top
ZX1  75.58,50.86 90 top

### Tracks (layer width: path | path; a pad name or v marks a point on that pad's centre or on a via)
2V5_REF  (via drill 0.3, 0.35)
  Top 0.305: U15.04 70.1,25.5 C38.1 | U6.04 56,14.19 C21.1 | 58.44,13.23 v58.48,13.27
  Top 0.61: C16.1 70.09,13.96 U12.6
  Top 0.813: C38.1 72.77,24.28 73.49,23.56 v73.49,23.33 | C21.1 58.44,13.23 | C16.1 72.34,14.84 R22.2 75.21,15.6 v75.25,15.56
  Route15 1.016: v73.49,23.33 73.49,21.6 71.35,19.46 71.36,19.44 | v58.48,13.27 58.48,10.81 59.58,9.72 64.33,9.72 66.61,12 66.61,14.69 71.36,19.44 | v75.25,15.56 71.36,19.44
3V3  (via drill 0.3, 0.35)
  Top 0.152: 29.27,13.02 v29.15,12.89
  Top 0.305: U6.28 47.73,13.69 47.18,13.14 47.18,11.41 C40.1 | U15.28 61.83,25 v61.53,24.7
  Top 0.508: v30.92,22.67 30.92,18.73 v29.27,17.08 29.27,13.02 | v29.15,12.89 29.15,9.06 28.51,8.42 28.51,6.41
  Top 0.61: 46.29,7.84 46.27,7.81
  Top 0.813: U16.3 19.24,58.6 | 14.67,58.6 14.67,65.53 | J2.27 16.19,41.97 14.67,43.5 14.67,58.6 | C40.1 v46.29,10.99 46.29,7.84 | U10.8 40.93,65.85 40.35,65.27 40.35,63.31 | 40.35,63.31 U10.6 | 40.35,63.31 40.35,59.27 39.62,58.55 | U8.8 59.55,7.81 v58.74,7.81 46.27,7.81 43.27,4.81 30.11,4.81 28.51,6.41 24.19,6.41 v22.8,5.02 | 19.24,58.6 14.67,58.6 | C33.1 61.07,24.24 v61.53,24.7 | U11.6 U11.7 U11.8 55.71,43.12 54.14,44.69 42.68,44.69 39.62,47.75 39.62,58.55 | 23.15,78.83 23.05,78.93 22.29,78.93 21.88,79.34 J9.2 | U16.8 14.67,65.53 | 19.24,58.6 39.55,58.6 39.62,58.67 39.62,58.55 | 14.67,65.53 14.67,68.52 | 14.67,68.52 14.67,73.09 14.8,73.22 | U$1.1 14.72,68.47 14.67,68.52
  Top 1.016: J9.1 23.15,78.83 24.4,77.58 24.4,74.74 23.43,73.77 v19.19,73.77 15.35,73.77 14.8,73.22 13.22,71.64 J1.24
  Route15 0.813: v22.8,5.02 22.57,4.79 16.17,4.79 15.18,5.78 | J2.27 16.19,41.97 15.18,40.96 15.18,5.78 | 15.18,5.78 13.27,5.78 JP14.1
  Bottom 0.305: v19.19,73.77 19.32,73.9 | 22.21,73.83 22.28,73.9 | U17.2 U17.3
  Bottom 0.508: R40.2 R39.2 v30.92,22.67 | R41.2 32.23,11.58 31.56,12.26 29.78,12.26 v29.15,12.89 | R42.2 32.46,16.43 31.81,17.08 v29.27,17.08 | 19.32,73.9 22.28,73.9 23.48,75.1 U17.2 | 22.21,73.83 U17.8
  Bottom 0.813: v61.53,24.7 61.53,10.6 v58.74,7.81 | v19.19,73.77 19.24,73.83 19.24,76.52 16.95,78.8 J3.2
5V0  (via drill 0.3, 0.35)
  Top 0.406: 21.35,75.45 11.98,75.45 11.51,74.99 11.51,72.86 10.29,71.64
  Top 0.457: 21.35,75.45 v21.4,75.5 | 10.29,71.64 J1.50
  Top 0.61: v55.74,82.99 55.92,82.99 | C1.1 56.71,84.9 | 59.53,82.87 U1.2
  Top 0.813: v54.55,84.26 55.18,84.9 C1.1 56.45,83.53 55.92,82.99 | 56.71,84.9 58.74,82.87 59.53,82.87 | U9.2 24.12,8.19 21.91,8.19 20.76,7.05 20.76,6.16 19.37,4.76 16.32,4.76 13.91,2.35 11.11,2.35 10.22,3.24 JP14.2 | v21.4,75.5 21.4,75.6 18.98,78.03 | J9.4 19.36,78.03 18.98,78.03 | J9.5 18.11,78.44 18.52,78.03 18.98,78.03
  Route15 0.406: 21.35,75.45 11.93,75.45 11.49,75.02 11.49,72.22 10.91,71.64 J1.50
  Route15 0.457: v21.4,75.5 21.35,75.45 21.6,75.45
  Route15 0.813: U9.2 U9.4
  Route15 1.016: v55.74,82.99 55.23,82.99 54.55,83.68 v54.55,84.26 33.49,84.26 24.73,75.5 v21.4,75.5 | U9.4 24.1,11.24 23.18,11.24 22.16,12.26 22.16,62.55 26.73,67.12 26.73,70.32 21.6,75.45
5V0_REF  (via drill 0.3, 0.35)
  Top 0.305: 82.65,86.55 C6.1 82.74,86.38 U2.9 | C5.1 80.45,86.67 | R21.2 58.77,48.27 | U15.21 58.42,28.49 C34.1 | U6.21 45.92,17.19 44.96,16.23 C41.1 | v71.41,25.72 71.13,26 U15.05 | U6.05 57.76,14.69 58.53,15.46 60.8,15.46 | 83.28,8.85 C43.1
  Top 0.406: 86.67,27.13 U18.5
  Top 0.508: 61.03,15.23 C15.1 | 86.67,27.13 C37.1 86.6,29.19 86.6,30.37 87.92,31.69 v89.22,31.69 | U19.5 81.57,8.85 83.28,8.85 | C43.1 86.34,8.79 v86.68,8.45 | U5.5 72.96,35.8 72.96,34.61 | v72.96,33.85 72.96,34.61 | C36.1 72.96,34.61
  Top 0.61: 58.77,48.27 U4.6 | v43.24,14.8 43.24,15.98 C41.1 C42.1 | C34.1 C35.1 55.94,28.03 v56.1,27.88 | U12.2 61.03,15.23
  Top 0.813: C5.1 82.65,86.55 | v75.76,68.01 77.95,68.01 R34.2 | 60.8,15.46 61.03,15.23 | v41.59,14.8 41.59,16.21 C42.1
  Top 1.016: 80.45,86.67 v80.45,88.43
  Top 1.27: v59.45,50.3 58.94,49.8 R21.2 60.51,48.21 v61.28,47.43 | v59.63,17.21 60.01,17.21 60.8,16.42 60.8,15.46
  Route15 0.61: JP15.4 87.49,51.07 86.17,52.39 86.17,70.42
  Route15 1.016: v75.76,68.01 83.76,68.01 86.17,70.42 86.55,70.8 86.55,85.53 83.65,88.43 v80.45,88.43
  Route15 1.27: v61.28,47.43 61.28,40.02 54.32,33.06 54.32,28.77 55.21,27.88 v56.1,27.88 56.1,25.9 59.86,22.14 66.18,22.14 | 66.18,22.14 69.1,22.14 71.41,24.45 v71.41,25.72 72.96,27.27 v72.96,33.85 | 66.18,22.14 66.18,18.55 65.21,17.59 60.01,17.59 v59.63,17.21 58,15.58 56.91,15.58 53.61,12.28 53.61,9.21 | 53.61,9.21 52.64,8.24 45.73,8.24 44.44,9.54 44.44,13.7 43.35,14.8 v43.24,14.8 v41.59,14.8 | v75.76,68.01 69.53,68.01 59.45,57.92 v59.45,50.3 | 53.61,9.21 53.61,9.13 57.34,5.4 73.09,5.4 74.26,6.57 85.56,6.57 86.68,7.68 v86.68,8.45 88.71,10.48 v88.71,15.05 89.22,15.56 v89.22,31.69 89.22,32.55 88.18,33.59 v85.66,33.59
  Bottom 0.406: 85.46,17.86 C24.1
  Bottom 0.508: U14.5 85.46,17.86 | C24.1 85.61,17.63 85.61,16.95 86.37,16.19 87.57,16.19 v88.71,15.05 | C11.1 82.54,31.85 82.54,33.29 | 82.54,33.29 U7.5 | v85.66,33.59 85.36,33.29 82.54,33.29
+V_SW  (via drill 0.3)
  Top 0.406: U3.7 83.58,74.43 84.14,74.99 v84.14,75.5
  Top 0.508: U4.2 C4.1
  Top 0.61: v65.6,67.88 65.6,66.61 | 65.6,66.61 65.6,64.83 66.33,64.1 R10.2 | R1.2 66.78,66.61 65.6,66.61 | U4.2
  Top 0.813: R29.2 53.38,27.96 51.59,27.96 v50.84,28.71 | C4.1 46.66,49.55 v46.57,49.64
  Top 1.016: C2.1 72.41,77.91 U1.7 69.76,74.46 65.6,70.29 v65.6,67.88
  Route15 1.016: v84.14,75.5 84.14,73.98 80.71,70.55 68.26,70.55 v65.6,67.88 63.77,67.88 46.57,50.68 v46.57,49.64 46.57,39.84 49.54,36.87 49.54,30.01 v50.84,28.71
  Bottom 0.61: v84.14,75.5 84.14,71.44 89.7,65.87 89.7,58.71 JP15.1
-INU5
  Top 0.406: R5.1 70.8,39.81 | 72.99,39.78 R6.2
  Top 0.508: 70.8,39.81 R6.2 | U5.4 72.99,39.78
-INU7
  Bottom 0.406: R12.2 81.66,38.21 82.56,38.21 | 82.56,38.21 R11.1 | U7.4 82.54,38.19 82.56,38.21
-INU14
  Bottom 0.406: 85.39,21.62 U14.4
  Bottom 0.508: 85.39,21.62 R36.2 85.42,23.61 87.54,23.61 R35.1
-INU18
  Top 0.406: U18.4 86.55,23.19 | 86.55,23.19 R46.2 | 86.97,22.77 86.55,23.19
  Top 0.508: R45.1 86.97,22.77
-INU19
  Top 0.305: R50.2 77.48,9.58 | 77.48,6.79 R49.1
  Top 0.508: U19.4 78.93,8.6 77.48,8.6 | 77.48,9.58 77.48,8.6 | 77.48,8.6 77.48,6.79
-V_SW  (via drill 0.3)
  Top 0.406: U3.4 76.44,73.14 v76.39,73.09
  Top 0.61: v58.61,67.25 R26.2 56.03,64.96 R25.2
  Top 1.016: U1.5 59.66,73.34 | 59.66,73.34 59.66,68.29 v58.61,67.25 | C3.1 59.66,73.34
  Route15 1.016: v58.61,67.25 64.58,73.22 76.26,73.22 v76.39,73.09
  Bottom 0.508: 88.13,56.15 JP15.2
  Bottom 0.61: v76.39,73.09 80.45,69.02 82.44,69.02 87.08,64.38 87.08,57.19 88.13,56.15
ADC_T_CS  (via drill 0.3)
  Top 0.305: U15.23 v57.59,27.5 | J2.23 16.83,31.81 16.07,32.58 16.07,34.61 17.08,35.62
  Top 0.406: U9.26 22.15,38.91 18.86,35.62 17.08,35.62
  Route15 0.406: v34.1,40.2 25.65,40.2 U9.26
  Bottom 0.406: v57.59,27.5 57.21,27.11 50.36,27.11 37.27,40.2 v34.1,40.2
ADC_V_CS  (via drill 0.3, 0.35)
  Top 0.305: U6.23 46.57,16.19 43.8,13.42 40.86,13.42 38.98,15.3 37.15,15.3 36.83,15.62 | 36.83,15.62 36.51,15.94 36.51,41.47 v33.46,44.51 | 36.83,15.62 36.83,15.37 v36.39,14.92
  Route15 0.406: v33.46,44.51 29.86,44.51 29.1,45.28 25.34,45.28 24.36,46.25 U9.32
  Bottom 0.305: v36.39,14.92 36.51,14.8
  Bottom 0.406: 36.51,14.8 36.51,12.76 37.78,11.49 J2.3
CH2
  Top 0.305: U5.3 76.29,38.42 76.29,41.01 75.37,41.92 71.79,41.92 70.5,43.22 ZX1.5
  Top 0.508: U5.3 77.37,37.71 R4.1
CH3
  Bottom 0.305: U7.3 77.88,36.06 R8.1 77.76,38.77 73.04,43.49 ZX1.7
CH4  (via drill 0.35)
  Top 0.406: R38.1 81.94,25.13
  Top 0.508: 81.94,25.13 U18.3 | R38.1 80.34,25.2 79.79,25.74 v79.79,26.4
  Bottom 0.305: v79.79,26.4 80.94,27.55 85.69,27.55 87.16,29.02 87.16,39.33 86.09,40.4 79.11,40.4 75.58,43.93 ZX1.9
CH6
  Bottom 0.305: R31.1 80.78,24.27 82.87,26.35 86.47,26.35 88.05,27.93 88.05,39.61 86.45,41.21 81.7,41.21 80.66,42.25 ZX1.13
  Bottom 0.508: U14.3 82.8,21.49 R31.1
CH7  (via drill 0.35)
  Top 0.305: R48.1 79.86,13.98 v78.5,13.98
  Top 0.508: R48.1 79.44,13.11 U19.3
  Bottom 0.305: ZX1.14 83.65,47.05 90.31,40.4 90.31,14.97 89.32,13.98 v78.5,13.98
CS_DAC  (via drill 0.3)
  Top 0.305: U2.6 84.87,83.27 v85.41,82.74 | J2.19 17.97,21.65
  Top 0.406: v34.35,47.31 32.58,47.31 29.15,43.88 29.15,38.93 27.88,37.66 25.65,37.66 U9.24 21.72,36.37 19.42,34.07 19.42,23.1 17.97,21.65
  Bottom 0.406: v85.41,82.74 60.72,82.74 34.35,56.38 v34.35,47.31
GND  (via drill 0.3)
  Top 0.305: 67.07,28 67.56,28.5 U15.10 70.39,28.5 v70.65,28.23 70.41,28 U15.09 67.08,28 67.07,28 | 67.07,28 67.07,27.67 v67.12,27.62 | U6.09 52.78,16.69 v52.64,16.83 53.01,17.19 U6.10 56.92,17.19 v56.96,17.23 56.96,16.69 U6.09
  other vias: 46.7,77.43 45.81,81.52 39.08,80.76 28,83.5 28,85.15 54.09,88.02 58.56,88.07 77.15,88.43 74.99,86.93 86.04,88.96 87.31,87.69 91.53,79.26 57.47,76.14 62.8,76.39 55.18,71.31 54.67,73.47 46.42,64.58 45.4,62.55 94.07,19.16 92.75,15.15 70.7,1.66 67.14,1.51 65.34,29.78 67.12,29.78 65.34,27.62 65.34,25.21 67.12,25.34 50.99,18.61 52.64,18.61 50.99,16.83 50.99,14.29 52.64,14.29 6.03,87.31 32.93,76.72 70.55,64.33 70.55,66.23 51.96,63.79 51.17,65.98 45.2,71.97 47.03,74.92 34.46,62.83 29.15,53.02 17.59,47.16 35.88,53.1 46.62,35.47 41.64,31.86 54.78,36.13 57.65,33.52 49.72,22.11 29.1,19.85 30.47,6.95 30.34,2.3 43.52,2.22 50.69,10.96 53.99,1.49 62.78,1.36 70.45,12.43 63.03,11.24 61.68,7.89 56.93,9.74 94.81,48.6 63.36,43.83 62.8,49.7 71.79,71.92 70.02,69.28 88.4,70.65 85.38,75.76 74.1,81.52 72.2,81.55 61.73,86.98 66.99,76.54 39.13,70.17 38.57,75.02 42.35,76.26 35.85,12.38 42.74,11.82 35.06,9.87 33.54,42.35 29.2,37.45 68.57,20.05 41.26,6.59 33.08,50.94 77.94,76.24 71.39,75.43 84.32,61.99 88.2,62.9 79.69,72.05 19.24,53.28 20.26,42.86 18.1,57.59 17.18,63.08 67.53,9.23 73.42,9.82 85.23,9.92 87.08,19.34 79.29,18.76 81.55,17.06 77.05,16.32 78.22,22.16 82.33,23.43 78.27,27.77 89.14,35.5 88.61,40.63 86.3,36.84 77.89,40.2 69.18,41.49 67.12,37.3 64.83,34.73 78.96,33.41
  pour Route2: -0.32,90.36 97.09,90.36 97.09,-1.33 -1.21,-1.33 -1.21,-0.95 -1.21,90.36
  pour Top: -1.08,91 97.09,91 97.09,-1.71 -1.08,-1.71
  pour Route15: -1.08,91 97.6,91 97.6,-1.46 -1.08,-1.46
  pour Bottom: -0.32,90.36 -0.32,-0.7 97.22,-0.7 97.22,90.36
MISO  (via drill 0.3)
  Top 0.305: U15.26 61.05,26 59.63,24.57 v59.63,24.45 | U6.26 47.84,14.69 40.83,7.68 35.88,7.68 32.88,10.68 v32.88,28.03
  Top 0.406: v32.88,33.87 v32.88,28.03
  Bottom 0.305: v59.63,24.45 59.37,24.19 | 32.91,28.05 v32.88,28.03
  Bottom 0.406: 32.91,28.05 43.32,28.05 47.18,24.19 59.37,24.19 | v32.88,33.87 32.27,34.48 R20.2
MISO_C
  Top 0.406: U9.21 25.65,32.58 22.42,32.58 21.15,31.31 21.15,15.43 19.75,14.03 J2.16
  Bottom 0.406: U9.21 27.55,34.48 R20.1
MOSI  (via drill 0.3)
  Top 0.305: U15.25 60.28,26.5 v59.88,26.1 | U6.25 47.45,15.19 42.48,10.22 36.13,10.22 34.28,12.08 v34.28,29.83 | U2.8 83.25,84.77 v83.63,85.15
  Top 0.406: v30.42,41.85 30.42,37.02 31.69,35.75 33.08,35.75 34.28,34.56 v34.28,29.83
  Bottom 0.305: R24.2 34.23,31.81
  Bottom 0.406: v59.88,26.1 59.25,25.46 47.69,25.46 42.61,30.54 35.5,30.54 34.23,31.81 | v34.28,29.83 34.06,30.05 R24.2 | v83.63,85.15 60.67,85.15 30.49,54.98 30.49,41.92 v30.42,41.85
MOSI_C
  Top 0.406: U9.19 25.65,30.04 23.05,30.04 22.34,29.32 22.34,14.39 20.71,12.76 16.7,12.76 16.07,13.4 16.07,15.81 16.83,16.57 J2.17
  Bottom 0.406: U9.19 27.42,31.81 R24.1
N$1
  Top 0.61: RFB2.2 74.28,72.6 76.42,70.46 84.14,70.46 RFB1.1
N$2
  Top 0.61: R9.2 R33.1
N$8
  Top 0.305: 70.83,36.79 73.57,36.79 74.54,35.83 U5.1
  Top 0.406: R5.2 70.83,36.79 | 75.63,35.78 U5.1
  Top 0.508: R7.2 75.07,33.85 75.63,34.4 75.63,35.78
N$9
  Top 0.305: U6.07 U6.08
N$10
  Bottom 0.406: R11.2 84.42,35.12 81.67,35.12 80.73,34.18 U7.1 80.18,33.95 R13.2
N$14
  Bottom 0.305: U14.1 82.89,19.7 83.76,19.7 84.72,20.66 87.44,20.66 R35.2
  Bottom 0.406: 82.87,17.68 R37.2
  Bottom 0.508: U14.1 82.87,17.68
N$15
  Top 0.305: U2.4 83.76,80.07 84.39,80.71 86.25,80.71 JP1.2
N$17
  Top 0.813: R29.1 53.4,24.7 | 53.4,24.7 R14.1 | 53.4,24.7 R30.2
N$18
  Top 1.016: R2.1 63.36,19.42 JP17.1
N$20
  Top 0.305: U18.1 84.77,27.01 85.66,26.12 88.46,26.12 88.84,25.74 R45.2
  Top 0.406: 83.86,27.11 U18.1
  Top 0.508: R47.2 83.86,27.11
N$22
  Top 0.406: U3.2 76.38,74.43 76.01,74.8 76.01,75.88 | 76.01,75.88 75.82,76.07 74.55,76.07 | 76.01,75.88 76.01,78.12 RG2.2
  Top 0.61: RG1.2 78.37,78.17 RG2.2 | 74.55,76.07 74.5,76.02 RFB2.1
N$24
  Top 0.305: 84.05,11.7 R51.2 | R49.2 80.33,6.79 80.33,9.82 81.32,10.81 U19.1
  Top 0.508: U19.1 84.05,11.7
N$25
  Top 0.305: U15.08 U15.07
OCH2
  Top 0.305: R7.1 74.17,31.09 72.4,32.85 60.87,32.85 60.11,32.09 60.11,30.65 60.76,30 U15.18
  Top 0.406: R7.1 76.95,31.09 C10.1
OCH3  (via drill 0.35)
  Top 0.305: v61.66,31.53 61.66,30.95 62.11,30.5 U15.17
  Bottom 0.305: R13.1 78.85,29.57 C23.1 73.15,30.76 71.89,32.02 62.14,32.02 v61.66,31.53
OCH4
  Top 0.305: C39.1 79.35,30.83 77.94,29.43 73.57,29.43 72.5,30.49 U15.14
  Top 0.508: R47.1 82.21,31.49 C39.1
OCH6  (via drill 0.35)
  Top 0.305: v76.19,27.7 74.08,27.7 72.28,29.5 U15.12
  Bottom 0.305: 80.17,15.55 C25.1 79.04,15.65 76.19,18.5 v76.19,27.7
  Bottom 0.508: R37.1 80.17,15.55
OCH7
  Top 0.305: 86.08,13.98 C44.1 82.19,17.87 77.74,17.87 75.55,20.05 75.55,25.03 71.59,29 U15.11
  Top 0.508: 86.08,13.98 R51.1
REF_DAC
  Top 0.305: U2.10 81.78,83.76 80.39,83.76 C7.1
  Top 0.61: RG1.1 78.75,81.09 80.36,82.7 C7.1
RX  (via drill 0.35)
  Route15 0.406: v20.26,18.35 19.49,17.59 19.49,13.14 J2.15
  Bottom 0.305: 24.45,68.44 U$1.4
  Bottom 0.406: 21.34,19.43 22.17,18.59 U9.10 | 21.34,19.43 21.02,19.75 21.02,62.67 24.45,66.1 24.45,68.44 | 21.34,19.43 v20.26,18.35
SCL-BUS  (via drill 0.35)
  Top 0.305: J9.7 15.56,80.3
  Top 0.406: 15.56,80.3 15.56,78.8 16.32,78.04 v16.32,76.9
  Bottom 0.305: J2.2 37.71,8.95 | 30.76,14.86 R42.1 | 16.32,77.03 v16.32,76.9 | 19.29,71.01 U$1.6
  Bottom 0.406: 37.71,8.95 33.03,13.63 31.99,13.63 30.76,14.86 | R42.1 28.82,15.43 U9.5 25.62,14.8 22.03,14.8 21.12,13.88 21.12,11.09 20.26,10.22 16.73,10.22 15.86,11.09 15.86,64.58 13.88,66.56 J1.22 11.52,67.83 11.52,77.81 12.26,78.55 14.8,78.55 16.32,77.03 | v16.32,76.9 17.59,75.63 17.59,72.71 19.29,71.01
SCL-DATA  (via drill 0.3)
  Top 0.406: U10.2 37.35,64.71 v30.29,64.71 23.18,64.71 21.96,63.49 19.93,63.49 19.24,64.17 U16.6 | U11.2 53.1,41.85 53.71,41.24 53.71,38.72 39.18,24.19 J2.8 J2.9 | U8.2 v53.53,5.02
  Bottom 0.305: 19.85,80.71 J3.4
  Bottom 0.406: v53.53,5.02 53.53,6.67 51.85,8.34 43.24,8.34 40.53,11.06 40.53,21.83 J2.8 35.37,24.19 34.66,24.9 R40.1 34.19,25.65 33.13,26.71 30.57,26.71 29.78,27.5 25.62,27.5 U9.18 24.05,28.75 22.9,29.91 22.9,57.82 23.43,58.36 29.02,58.36 30.29,59.63 v30.29,64.71 30.29,70.42 27.22,73.49 27.22,74.87 | 19.85,80.71 26.1,80.71 27.22,79.59 27.22,74.87 | U17.6 24.75,74.28 25.34,74.87 27.22,74.87
SCLK  (via drill 0.3)
  Top 0.305: U15.24 59,27 v58.48,26.48 | U6.24 47.06,15.69 44.13,12.76 37.02,12.76 35.42,14.36 35.42,36.23 v35.39,36.26 | U2.7 83.76,84.14 84.14,84.52 v85.28,84.52
  Bottom 0.305: v85.28,84.52 85.23,84.52 | 34.23,37.69 R23.2
  Bottom 0.406: v58.48,26.48 48.96,26.48 37.91,37.53 35.39,37.53 | 35.39,37.53 R23.2 | 85.23,84.52 84.64,83.93 60.56,83.93 31.94,55.31 31.94,40.58 34.23,38.29 34.23,37.69 | 35.39,37.53 v35.39,36.26
SCLK_C
  Top 0.406: U9.23 25.65,35.12 22.42,35.12 20.26,32.96 20.26,20.38 18.99,19.11 J2.18
  Bottom 0.305: 28.57,36.39 28.55,36.37
  Bottom 0.406: U9.23 28.55,36.37 | 28.57,36.39 31.22,36.39 R23.1
SDA-BUS  (via drill 0.35)
  Top 0.406: v14.8,76.9 14.8,77.69 14.32,78.16 J9.8 10.73,80.33 v10.48,80.07
  Bottom 0.305: 27.25,10.63 U9.3 26.9,11.2 | 12.94,64.02 J1.21 | 10.22,80.07 v10.48,80.07
  Bottom 0.406: 27.25,10.63 R41.1 30.53,8.71 32.83,6.41 J2.1 | 26.9,11.2 25.86,12.24 23.17,12.24 22.49,11.57 22.49,10.12 20.05,7.68 16.19,7.68 15.05,8.83 15.05,61.91 12.94,64.02 | v14.8,76.9 15.43,76.26 15.43,72.38 U$1.5 | J1.21 11.49,65.32 9.61,65.32 8.98,65.95 8.98,78.83 10.22,80.07
SDA-DATA  (via drill 0.3, 0.35)
  Top 0.305: 28.26,66.1 v28.13,65.98 | v25.59,79.44 25.72,79.44
  Top 0.406: U10.1 37.22,66.1 28.26,66.1 | U11.1 53.33,43.12 54.72,41.72 54.72,38.29 38.16,21.73 J2.7 | U8.1 v51.63,6.29 | U16.5 20.96,65.98 v28.13,65.98 27.88,66.23 27.88,77.28 25.72,79.44
  Bottom 0.305: R39.1 36.87,22.67 37.88,21.65 J2.7 38.54,21.65 | 24.33,26.21 U9.16 | 26.02,71.89 U17.5
  Bottom 0.406: U9.16 25.62,24.96 28.26,24.96 29.27,23.94 29.27,22.16 30.54,20.89 33.72,20.89 34.19,21.36 R39.1 | v51.63,6.29 43.62,6.29 39.61,10.3 39.61,20.59 38.54,21.65 | 24.33,26.21 22.03,28.51 22.03,58.74 22.67,59.37 27.44,59.37 28.13,60.06 v28.13,65.98 27.75,66.36 27.75,70.17 26.02,71.89 | J3.3 18.21,79.32 18.73,78.8 20.38,78.8 21.32,79.74 25.29,79.74 v25.59,79.44
TX  (via drill 0.35)
  Top 0.406: v20,11.62 20,9.72 19.24,8.95 J2.14
  Bottom 0.305: U9.8 24.11,15.8 | 21.91,68.44 U$1.3
  Bottom 0.406: 20.76,15.79 19.19,17.36 19.19,49.52 16.95,51.75 16.95,61.02 21.91,65.98 21.91,68.44 | 24.11,15.8 20.78,15.8 20.76,15.79 | 20.76,15.79 20,15.03 v20,11.62
VAR_CH0
  Top 0.305: U6.20 46.61,17.69 C22.1 44.98,18.9 43.59,20.3 R28.2
VAR_CH2
  Top 0.305: U6.18 47.73,18.69 47.18,19.24 C27.1
  Top 0.813: C27.1 R27.2
VAR_CH4
  Top 0.305: U6.14 55.77,19.19 56.07,19.49 56.07,21.82 C28.1
  Top 0.813: C28.1 R14.2
VAR_CH6
  Top 0.305: U6.12 57.51,18.19 58.03,18.71 C26.1
  Top 0.813: R2.2 59.73,19.41 C26.1
VDRAIN  (via drill 0.3, 0.35)
  Top 0.61: JP13.1 87.11,48.91 87.11,55.64 85.79,56.96 85.79,58.99 | 85.79,58.99 85.79,62.93 | 85.79,58.99 v82.49,58.99
  Top 0.66: JP6.2 89.6,66.74 85.79,62.93
  Top 0.813: R28.1 41.89,22 41.34,22.54 v41.34,23.05
  Route15 1.016: v41.34,23.05 40.32,24.07 40.32,52.54 43.55,55.77 v43.55,55.82
  Bottom 0.66: v82.49,58.99 82.46,58.97 74.16,58.97 73.04,57.85 ZX1.27
  Bottom 1.016: ZX1.27 ZX1.29 70.5,59.29 68.44,61.35 58.69,61.35 53.15,55.82 v43.55,55.82
VOUT_SW
  Top 0.305: RFB1.2 84.87,72.9
  Top 0.406: U3.6 83.79,73.77 RFB1.2 | 87.19,69.17 C12.1
  Top 0.508: R15.2 86.26,65.47 87.19,66.4 87.19,69.17 R3.2
  Top 0.61: 84.87,72.9 R3.2
VOUTA
  Top 0.305: U3.3 79.49,73.77 80.58,74.87 C8.1 80.9,78.91 U2.1
VOUTB
  Top 0.305: U2.2 82.74,77.56 83.29,77.01 C9.1 88.31,77.01 88.53,76.8 JP6.1
VSW_COND  (via drill 0.3, 0.35)
  Top 0.305: 79.82,65.51 R32.1
  Top 0.61: R34.1 79.82,67.84 79.82,65.51
  Top 0.813: R27.1 44.43,23.9 v43.37,24.96
  Top 1.016: R32.1 78.8,65.47 | 78.8,65.47 R33.2 | 78.8,65.47 v78.8,63.06
  Route15 1.016: v43.37,24.96 43.37,51.37 v52.64,60.64
  Bottom 0.61: v78.8,63.06 80.91,63.06 85.38,58.59 85.38,55.99 87.77,53.61 JP15.3
  Bottom 1.016: v78.8,63.06 78.55,62.8 69.79,62.8 69.15,63.44 55.44,63.44 v52.64,60.64
VSWEEP
  Top 0.61: JP13.2 88.86,43.75 85.64,46.98 85.64,55.11 83.4,57.34 80.79,57.34 ZX1.21 | R32.2 R15.1
  Top 0.66: ZX1.23 ZX1.21 80.66,61.59 81.56,62.48 R32.2

### Text on the board
tNames: TG_SAT - V1.4 / 20211108 - SPEL - UCHILE | CP | CP | DC | DC | +V | -V | VSW_C | 5V0_REF | VD | VSW | GND | 5V0 | 3V3
bNames: SPI | DATA | BUS